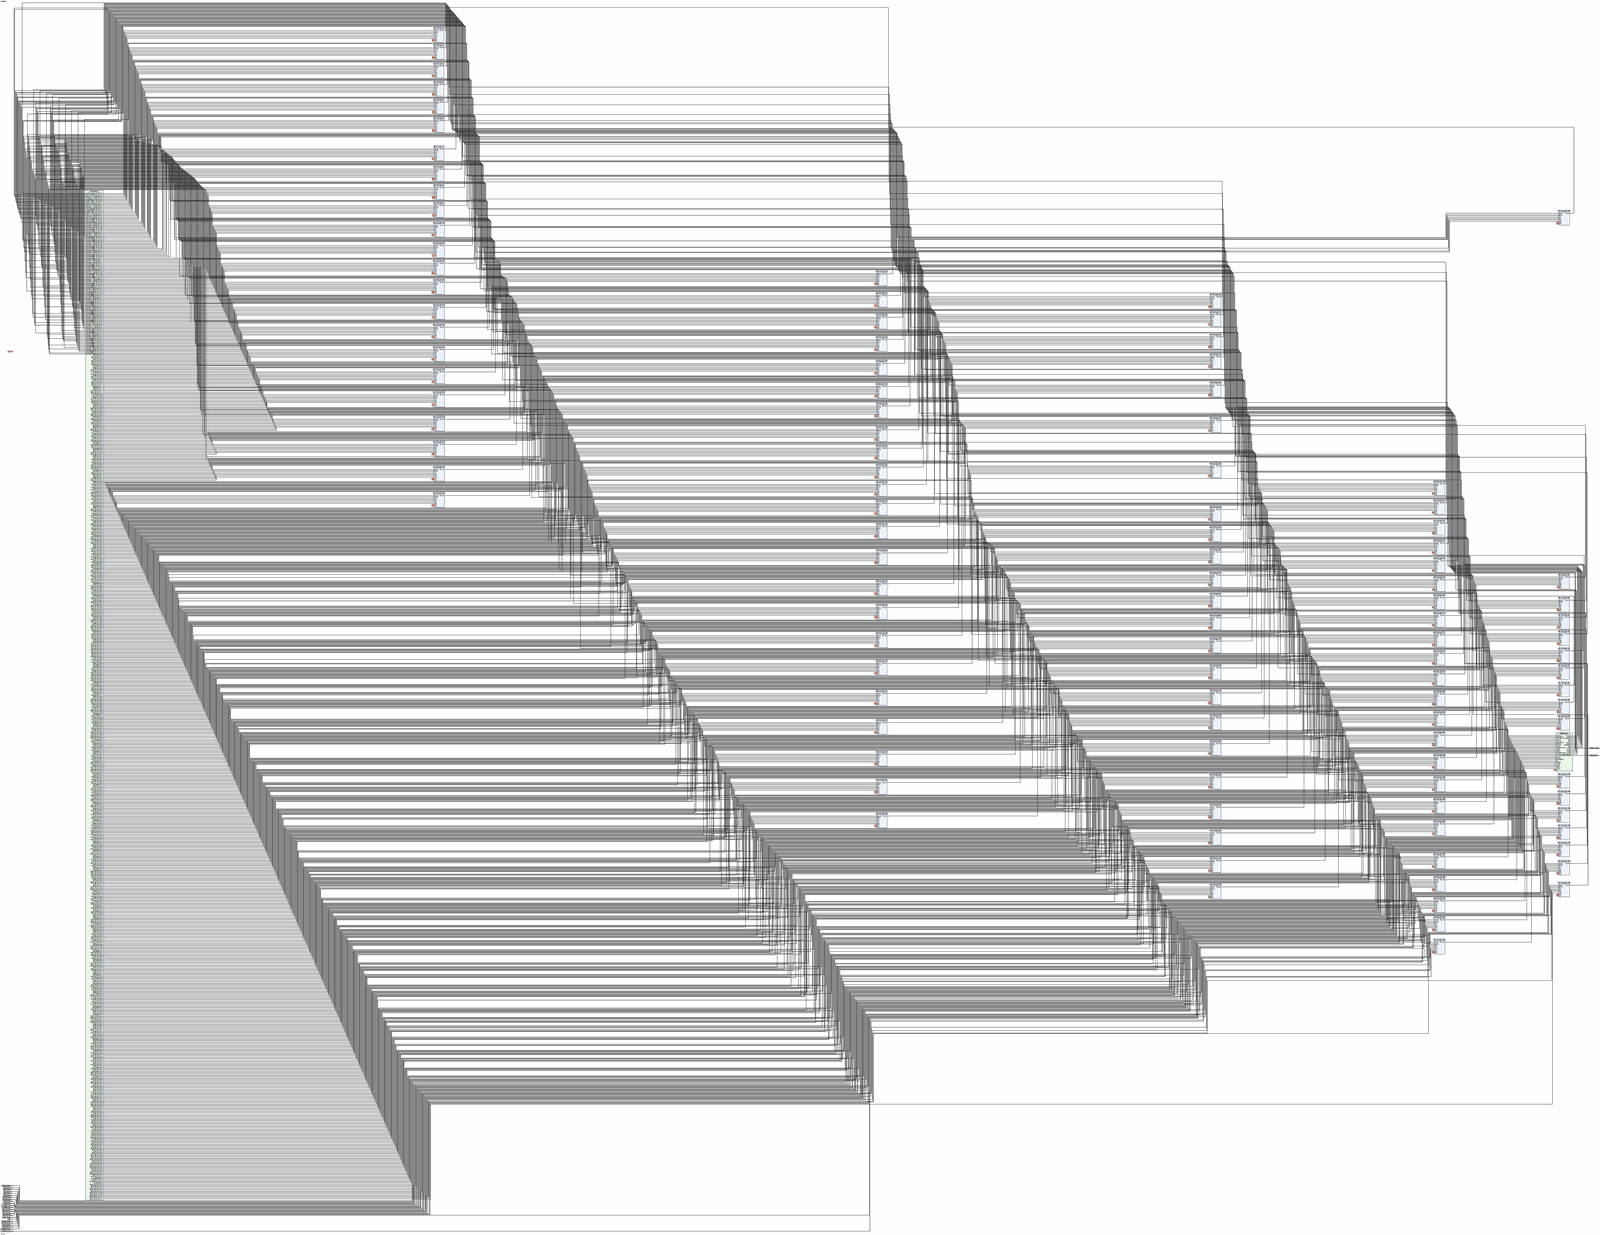
[diagram p0: block diagram of the top level, whole]
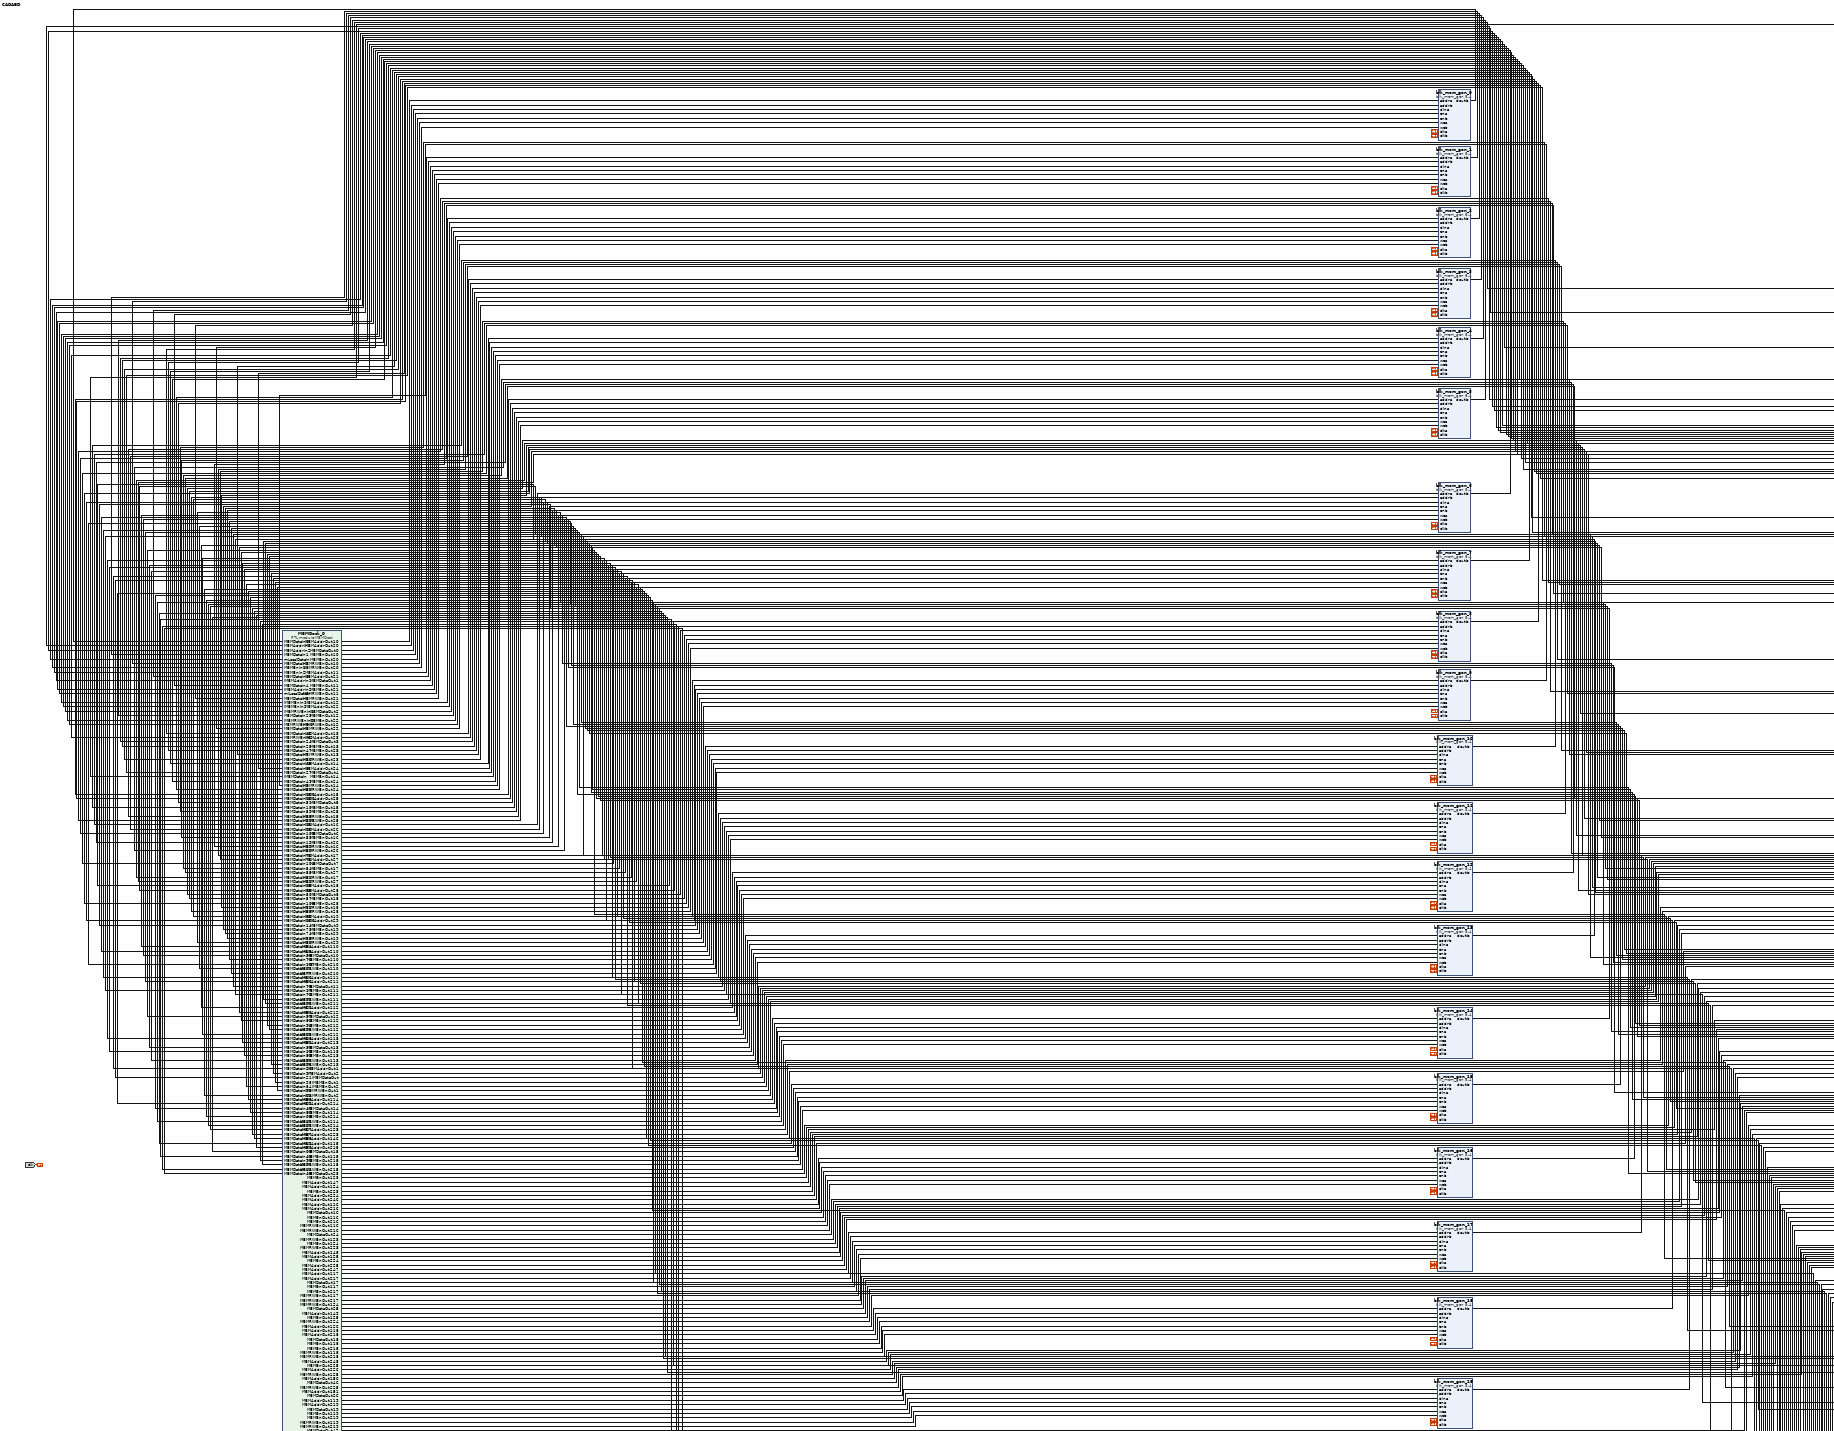
[diagram p1: block diagram of the top level, upper left part]
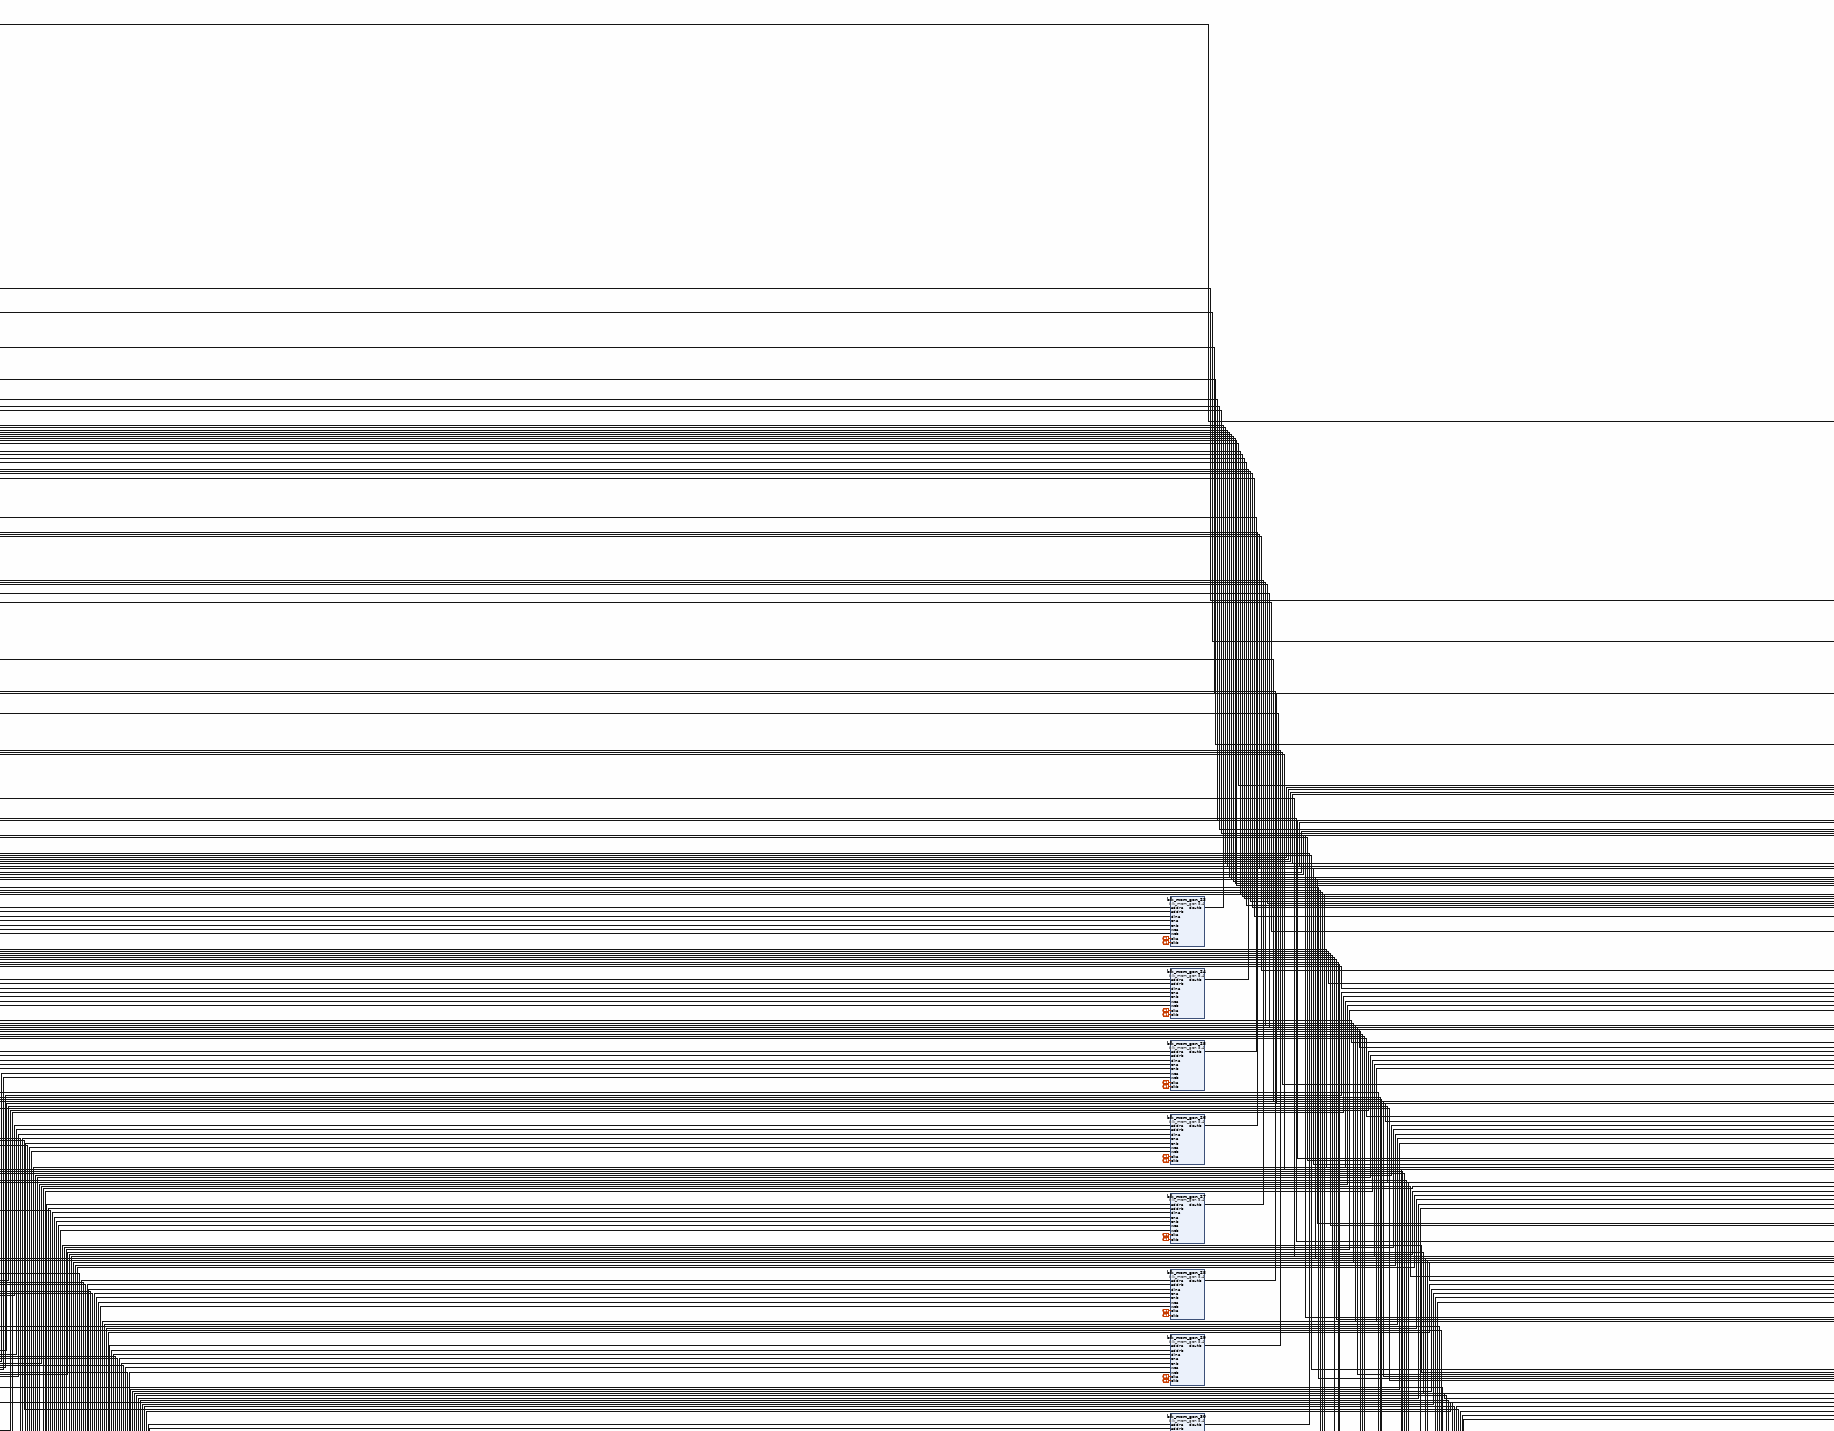
[diagram p2: block diagram of the top level, upper centre part]
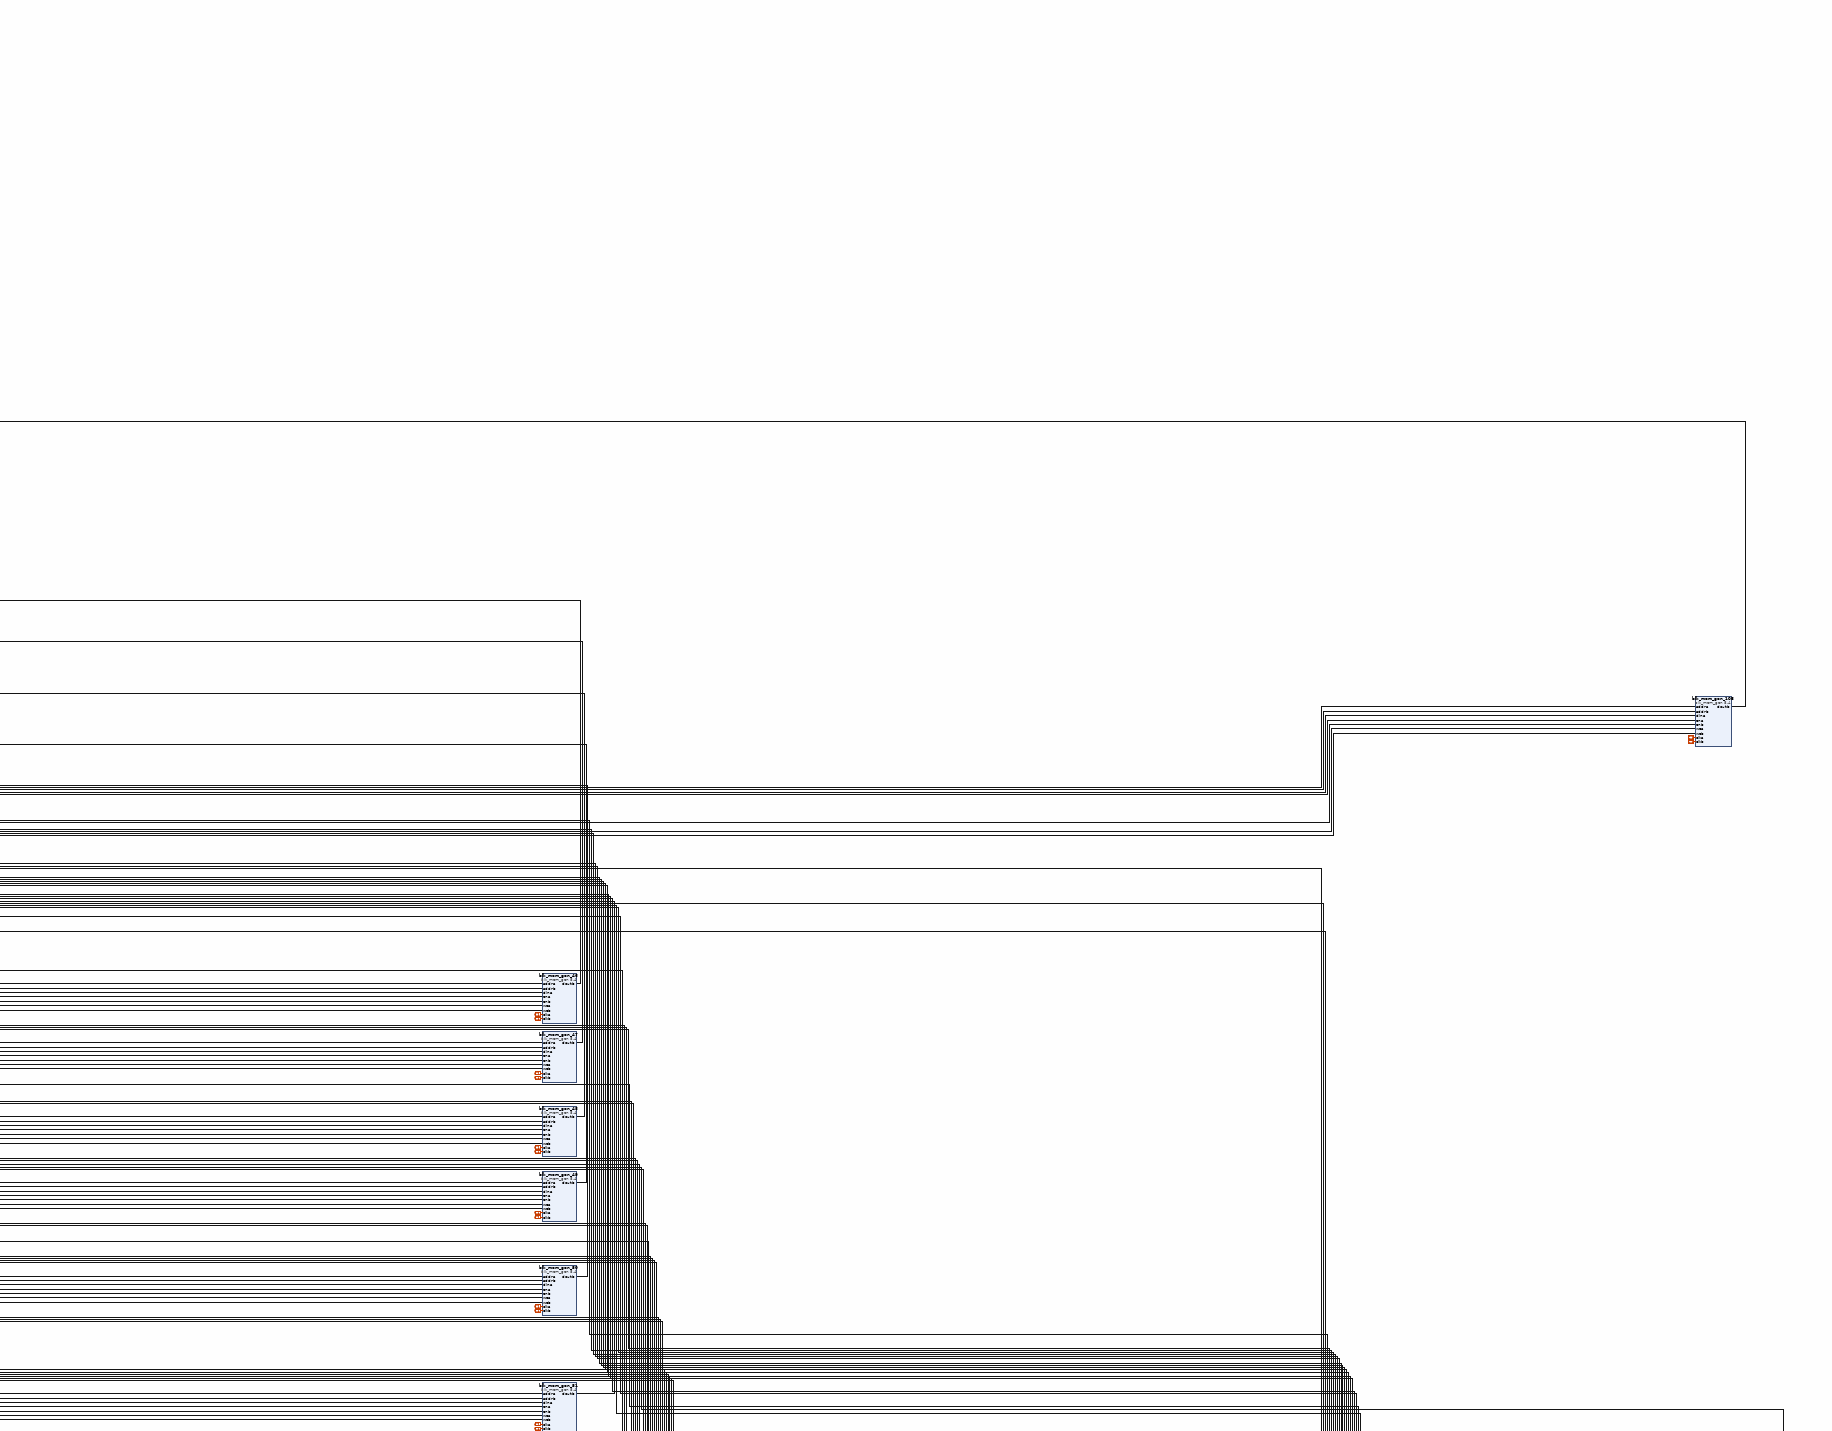
[diagram p3: block diagram of the top level, upper right part]
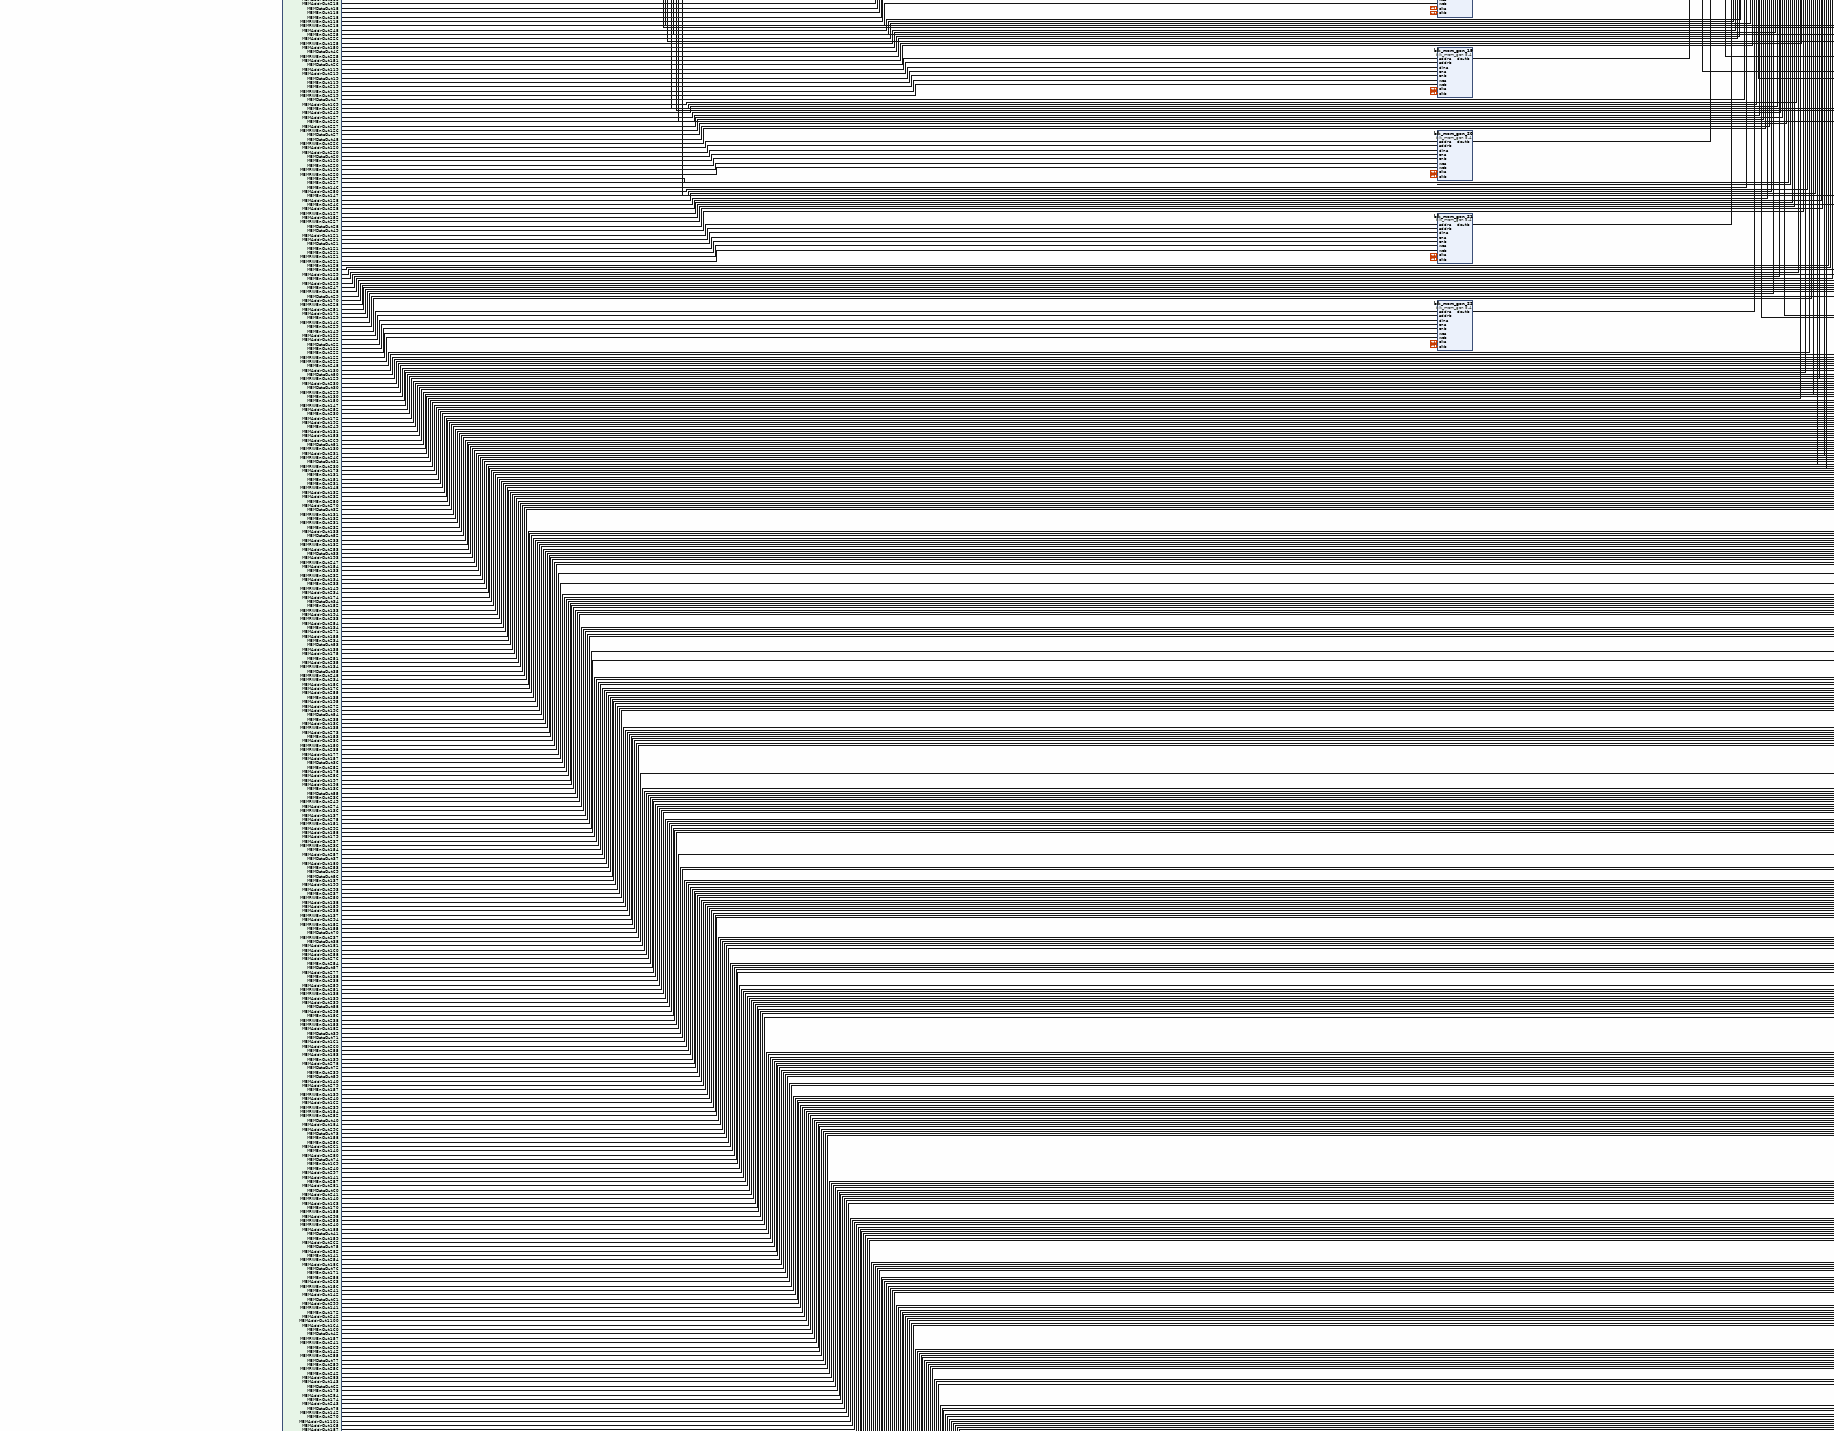
[diagram p4: block diagram of the top level, middle left part]
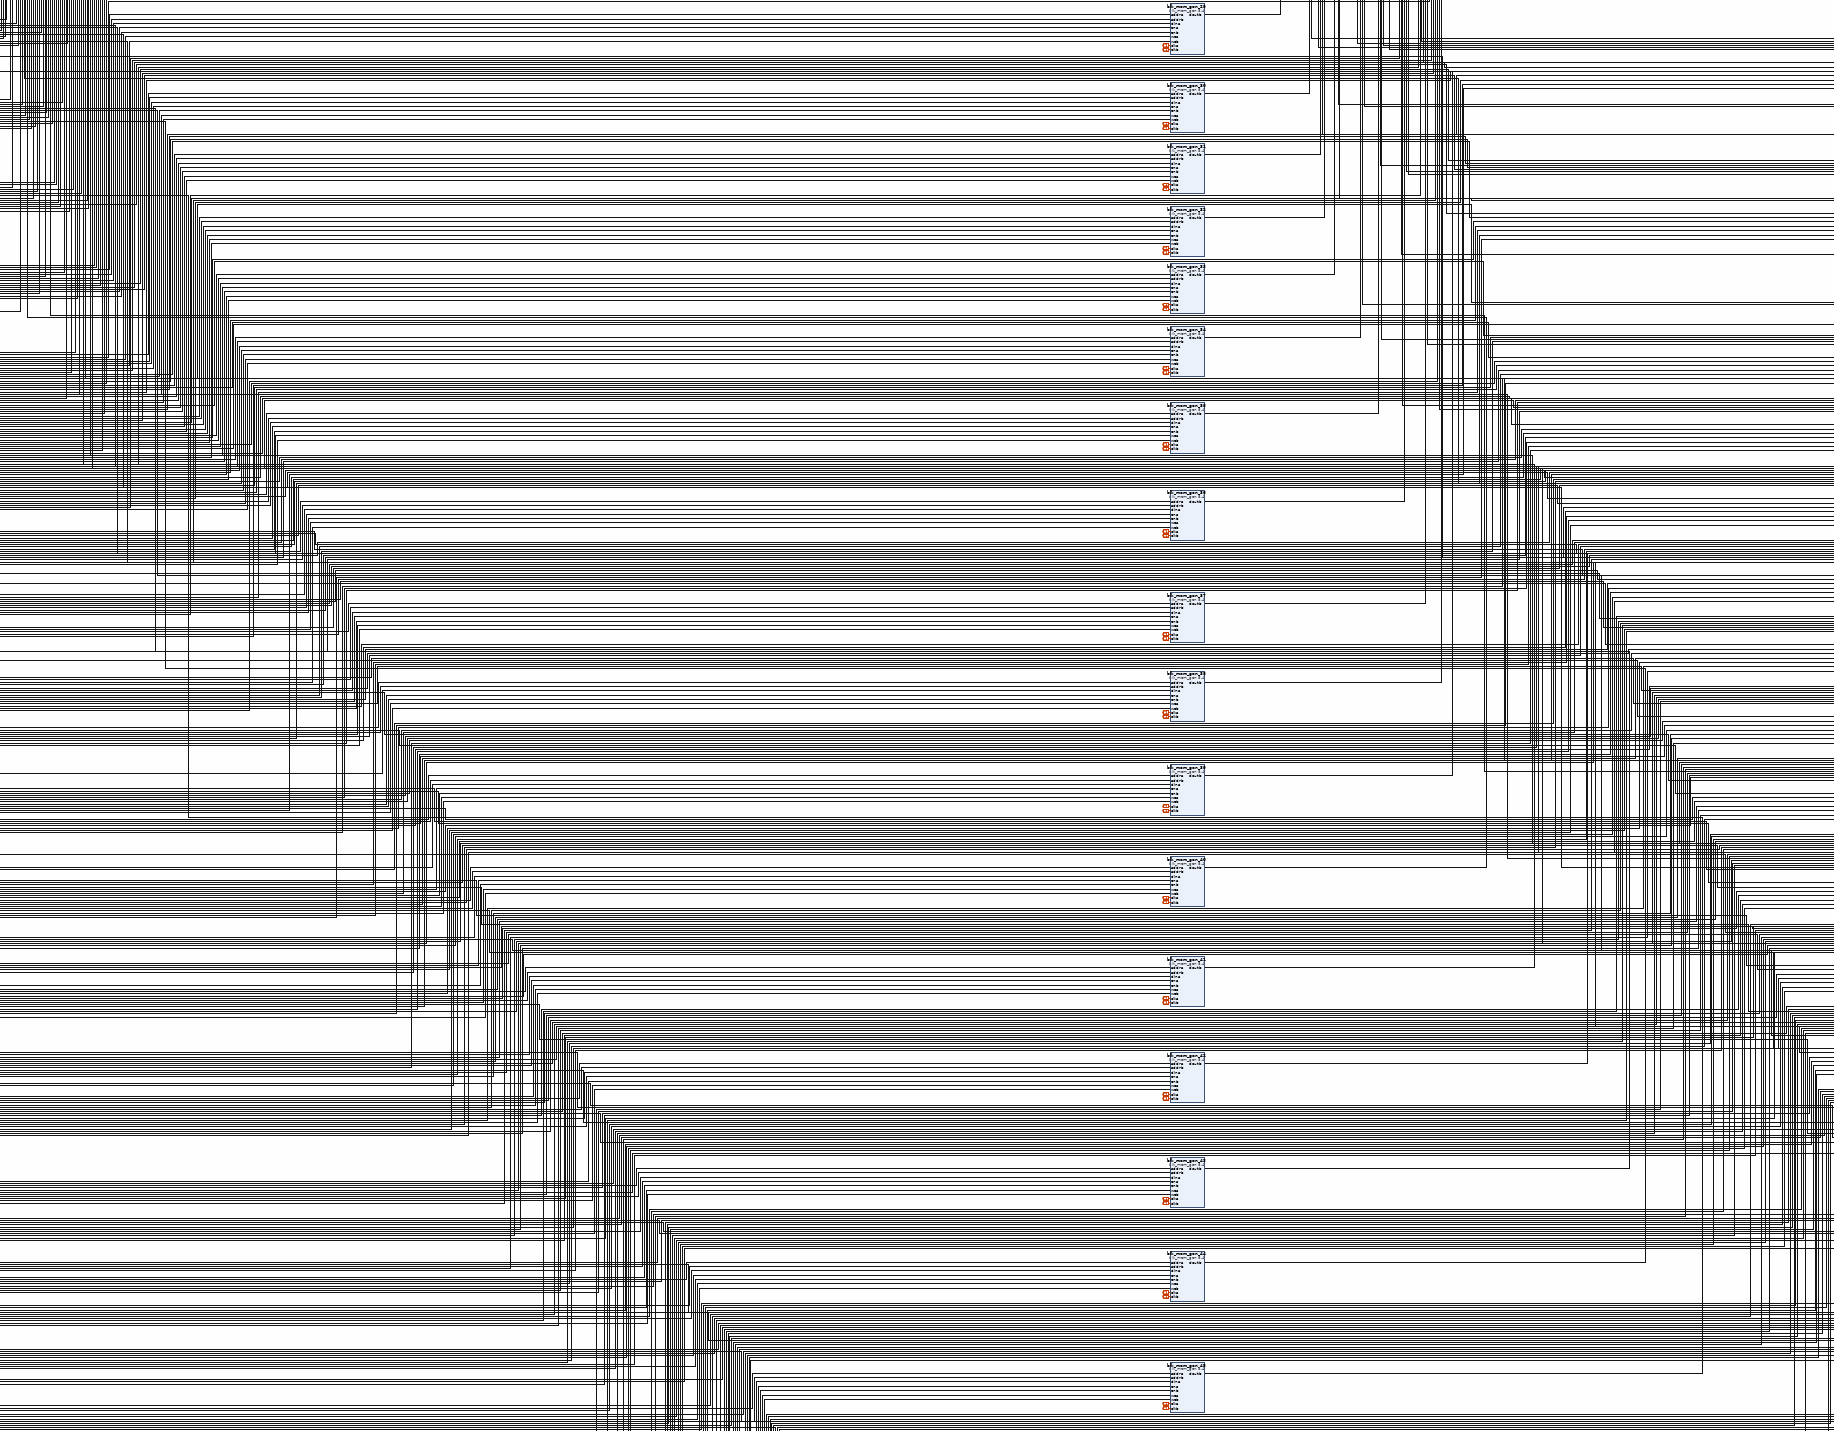
[diagram p5: block diagram of the top level, middle centre part]
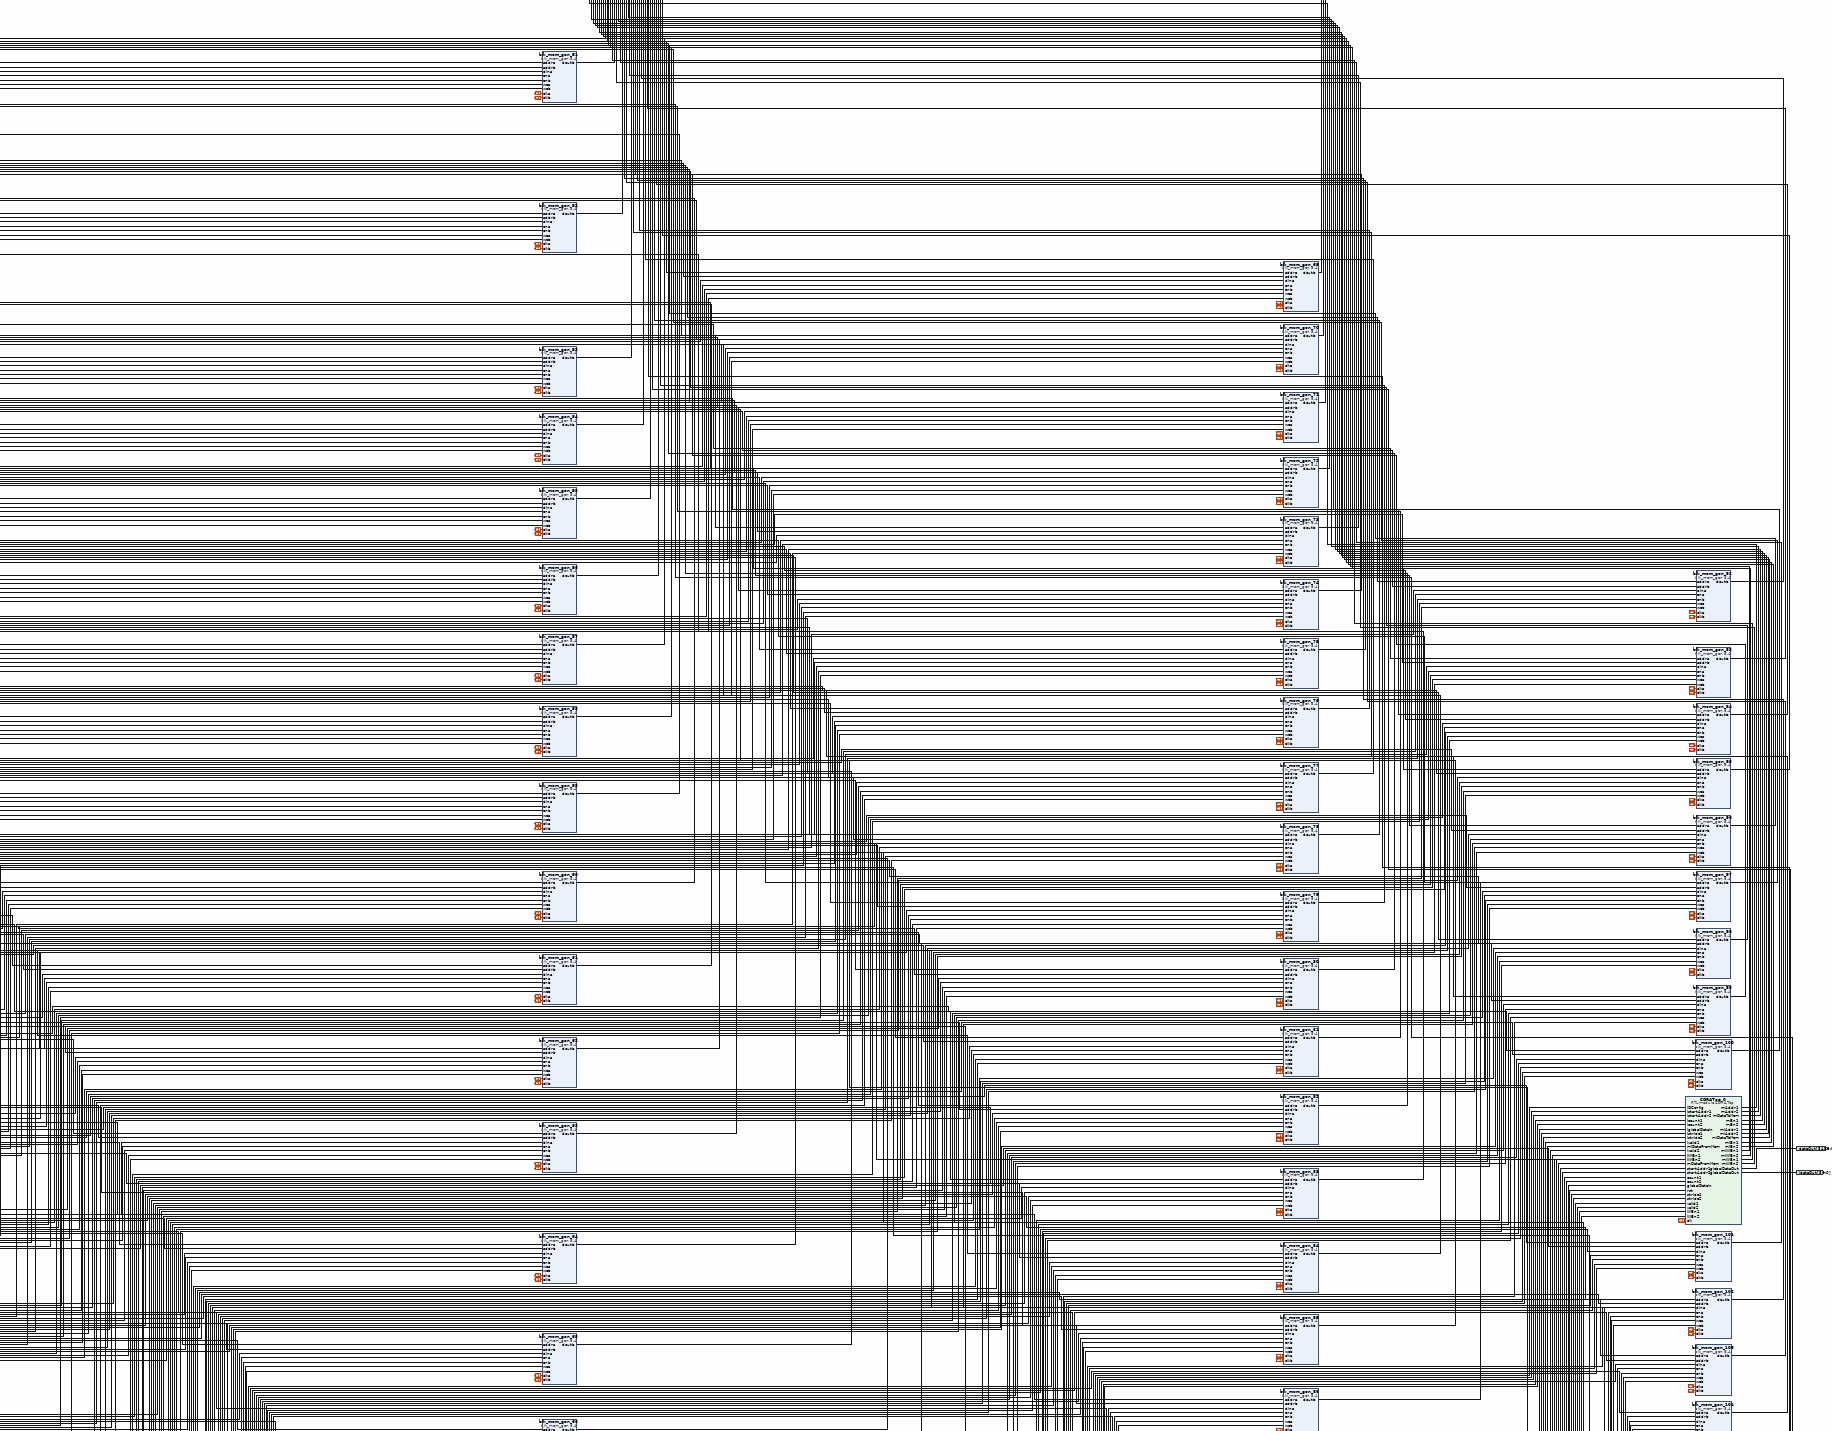
[diagram p6: block diagram of the top level, middle right part]
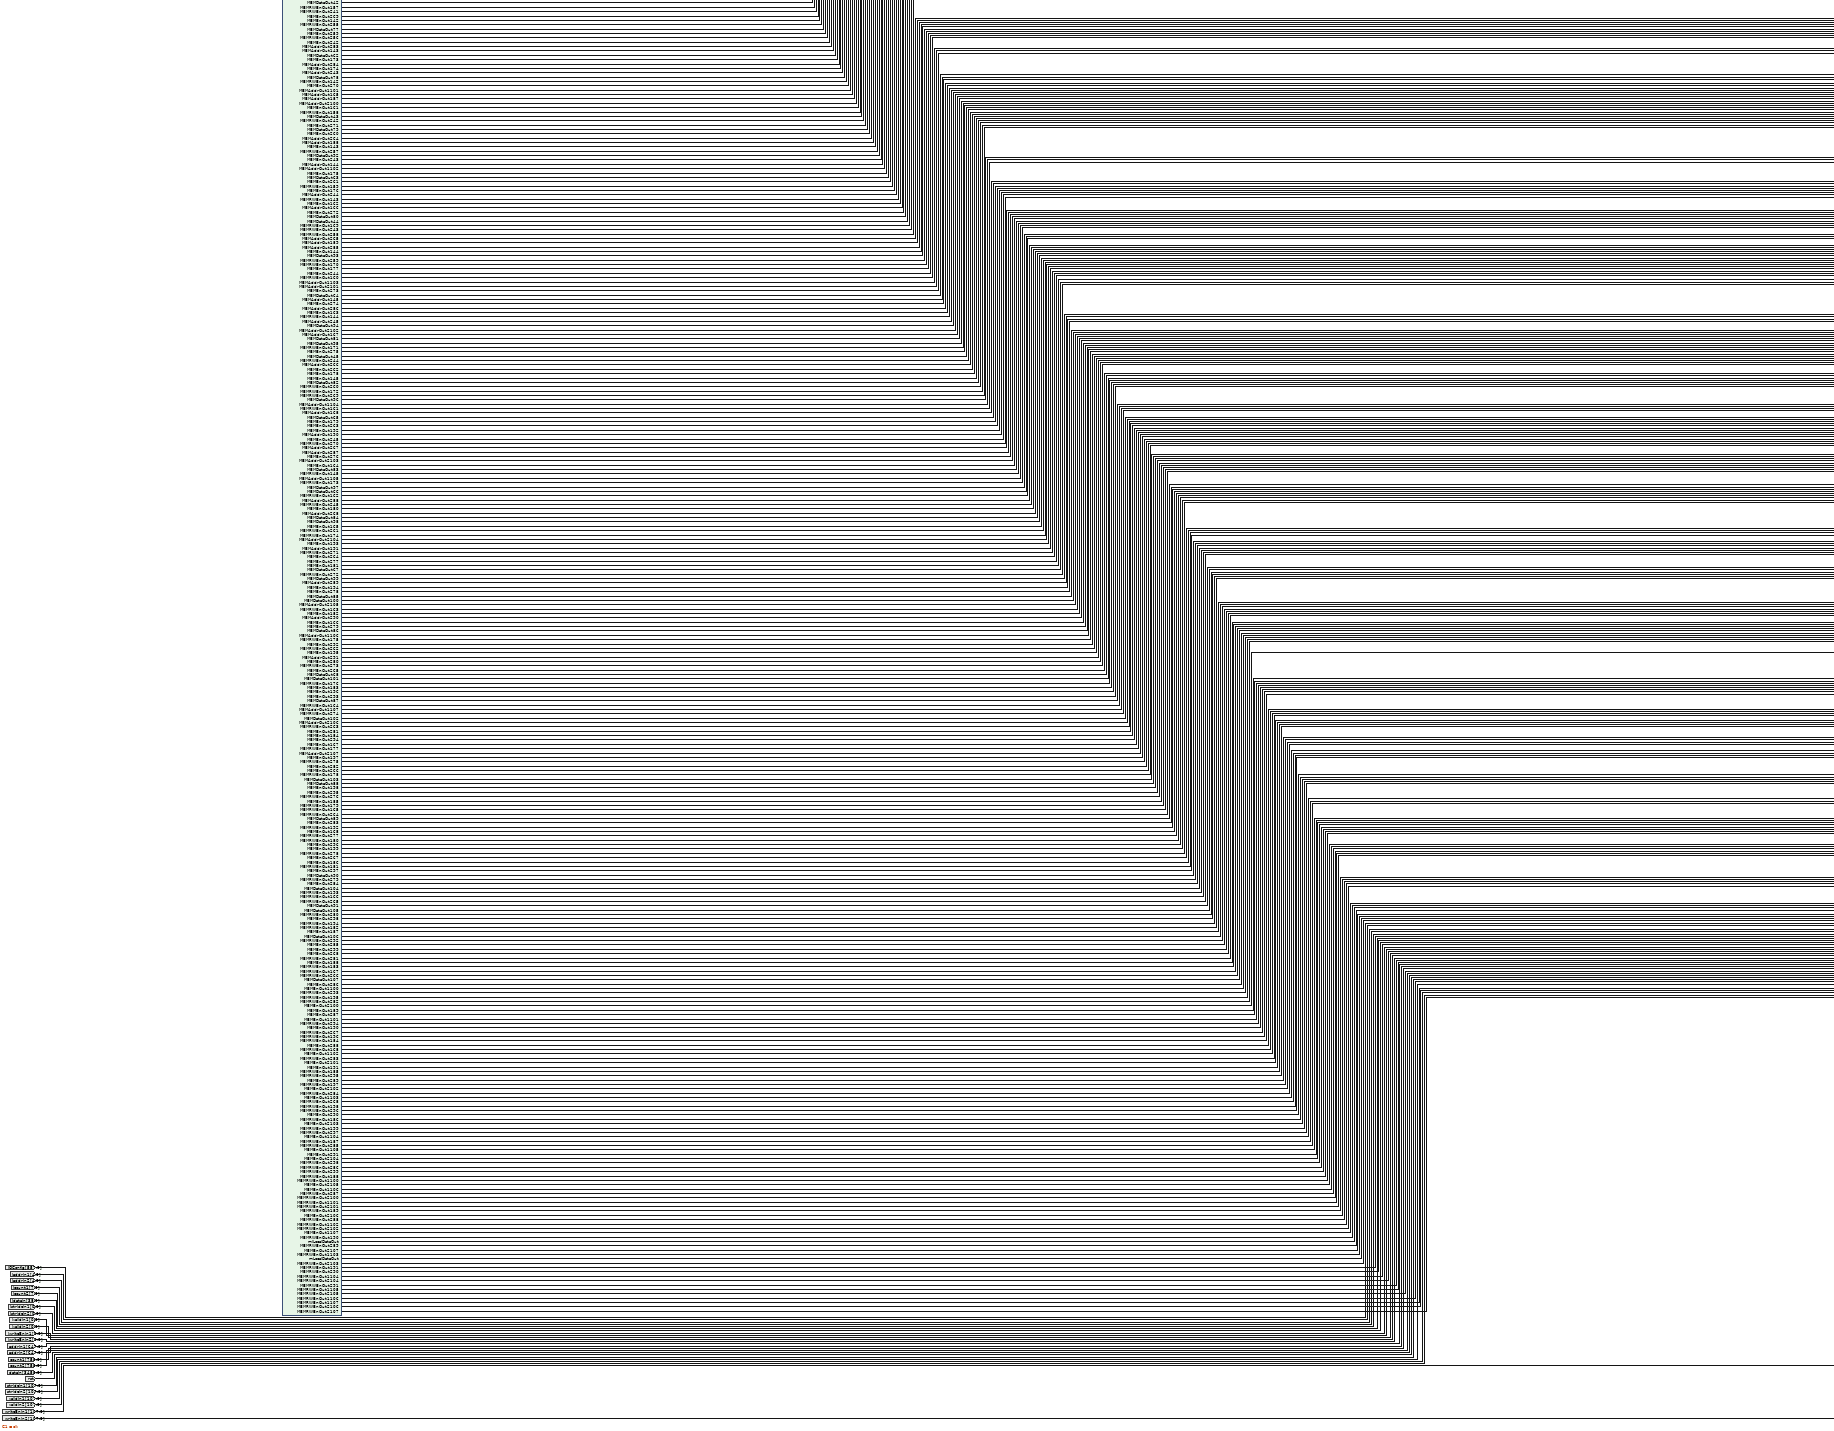
[diagram p7: block diagram of the top level, lower left part]
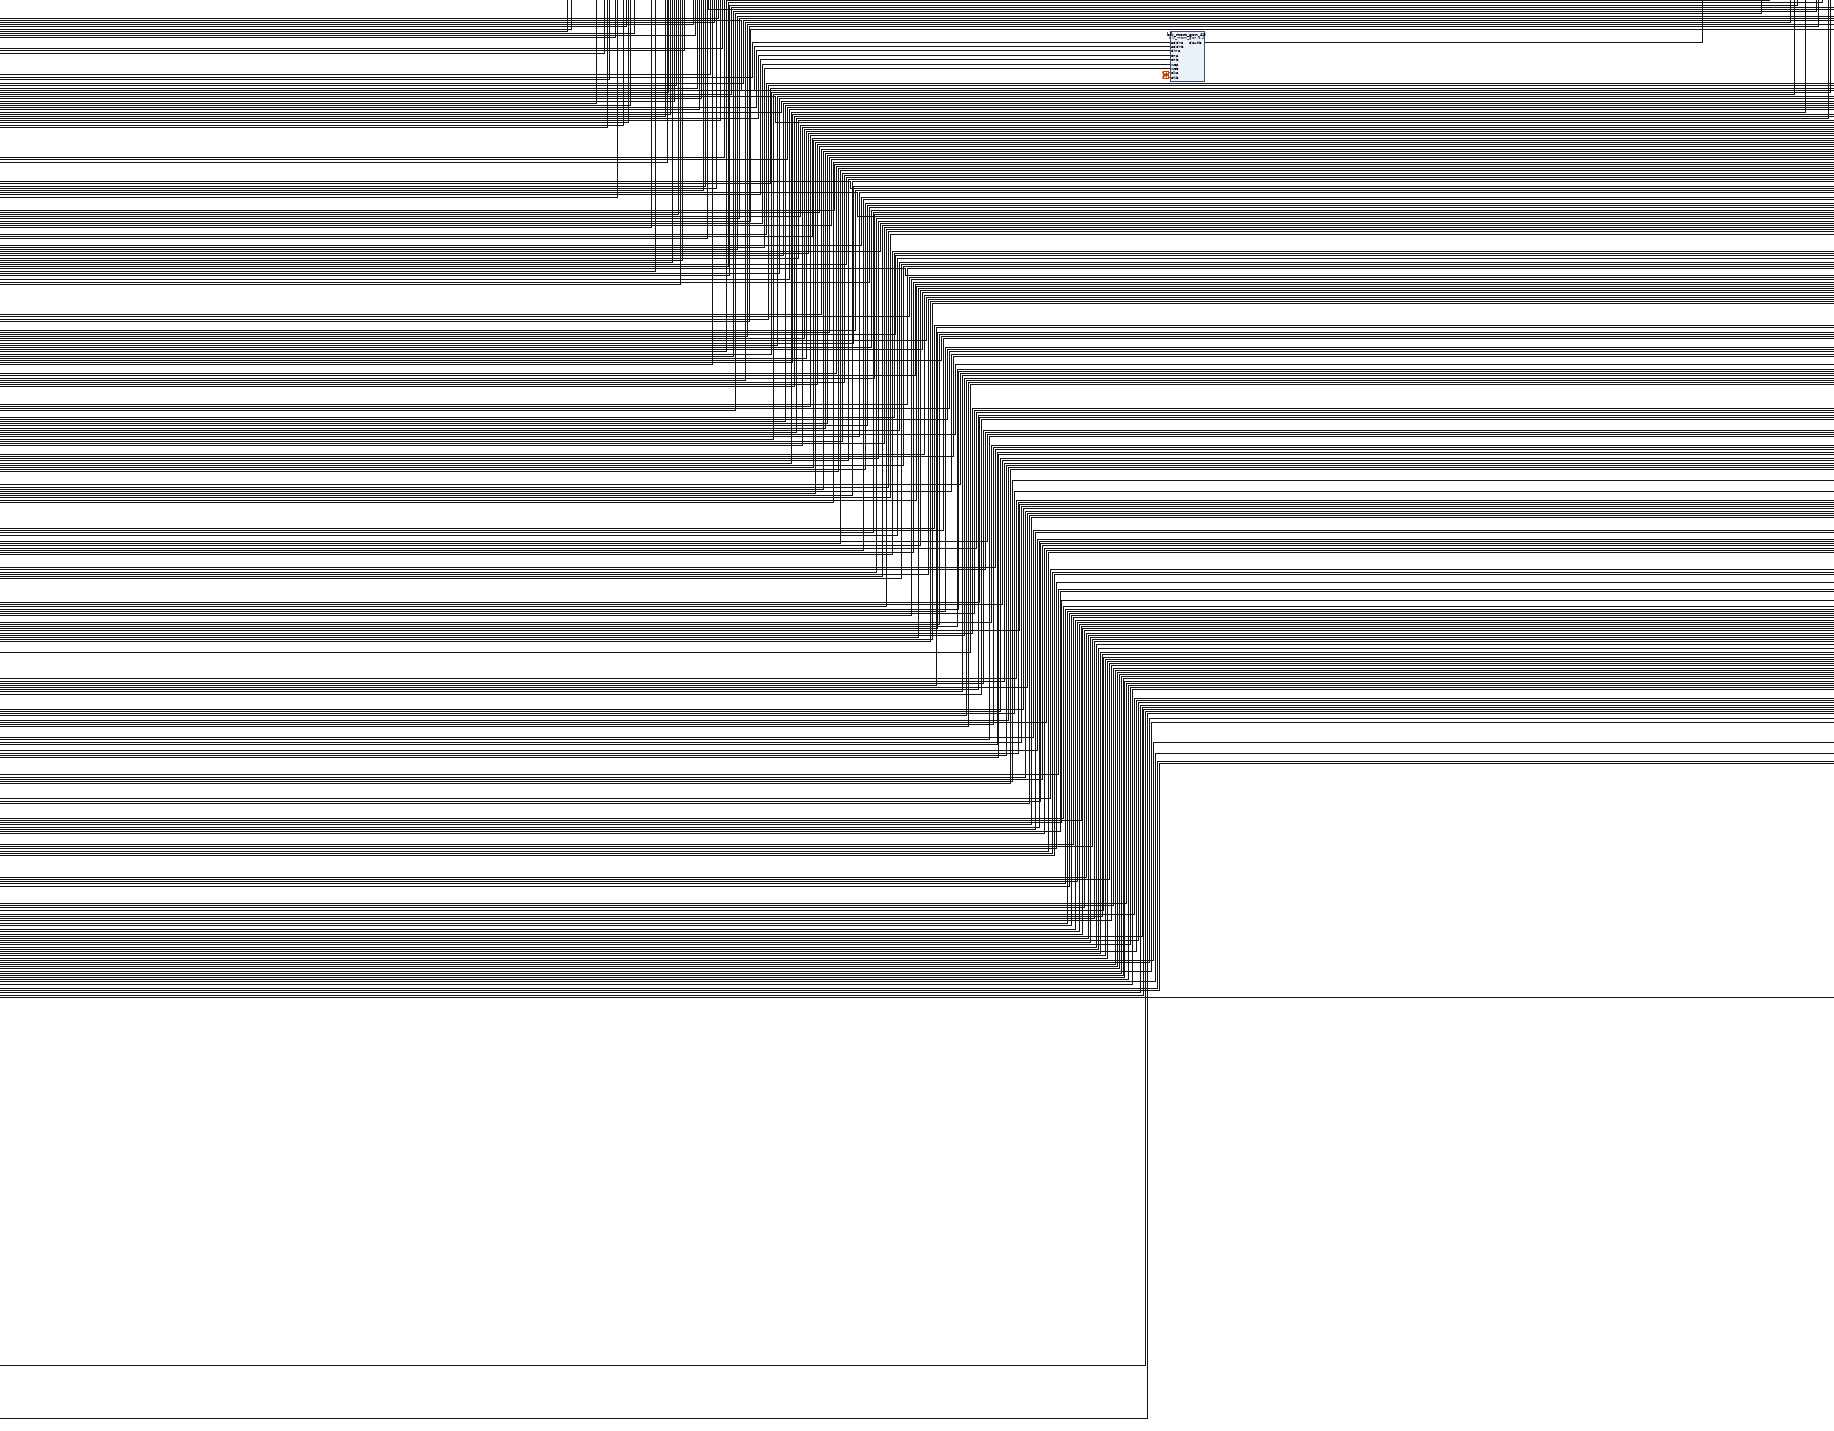
[diagram p8: block diagram of the top level, lower centre part]
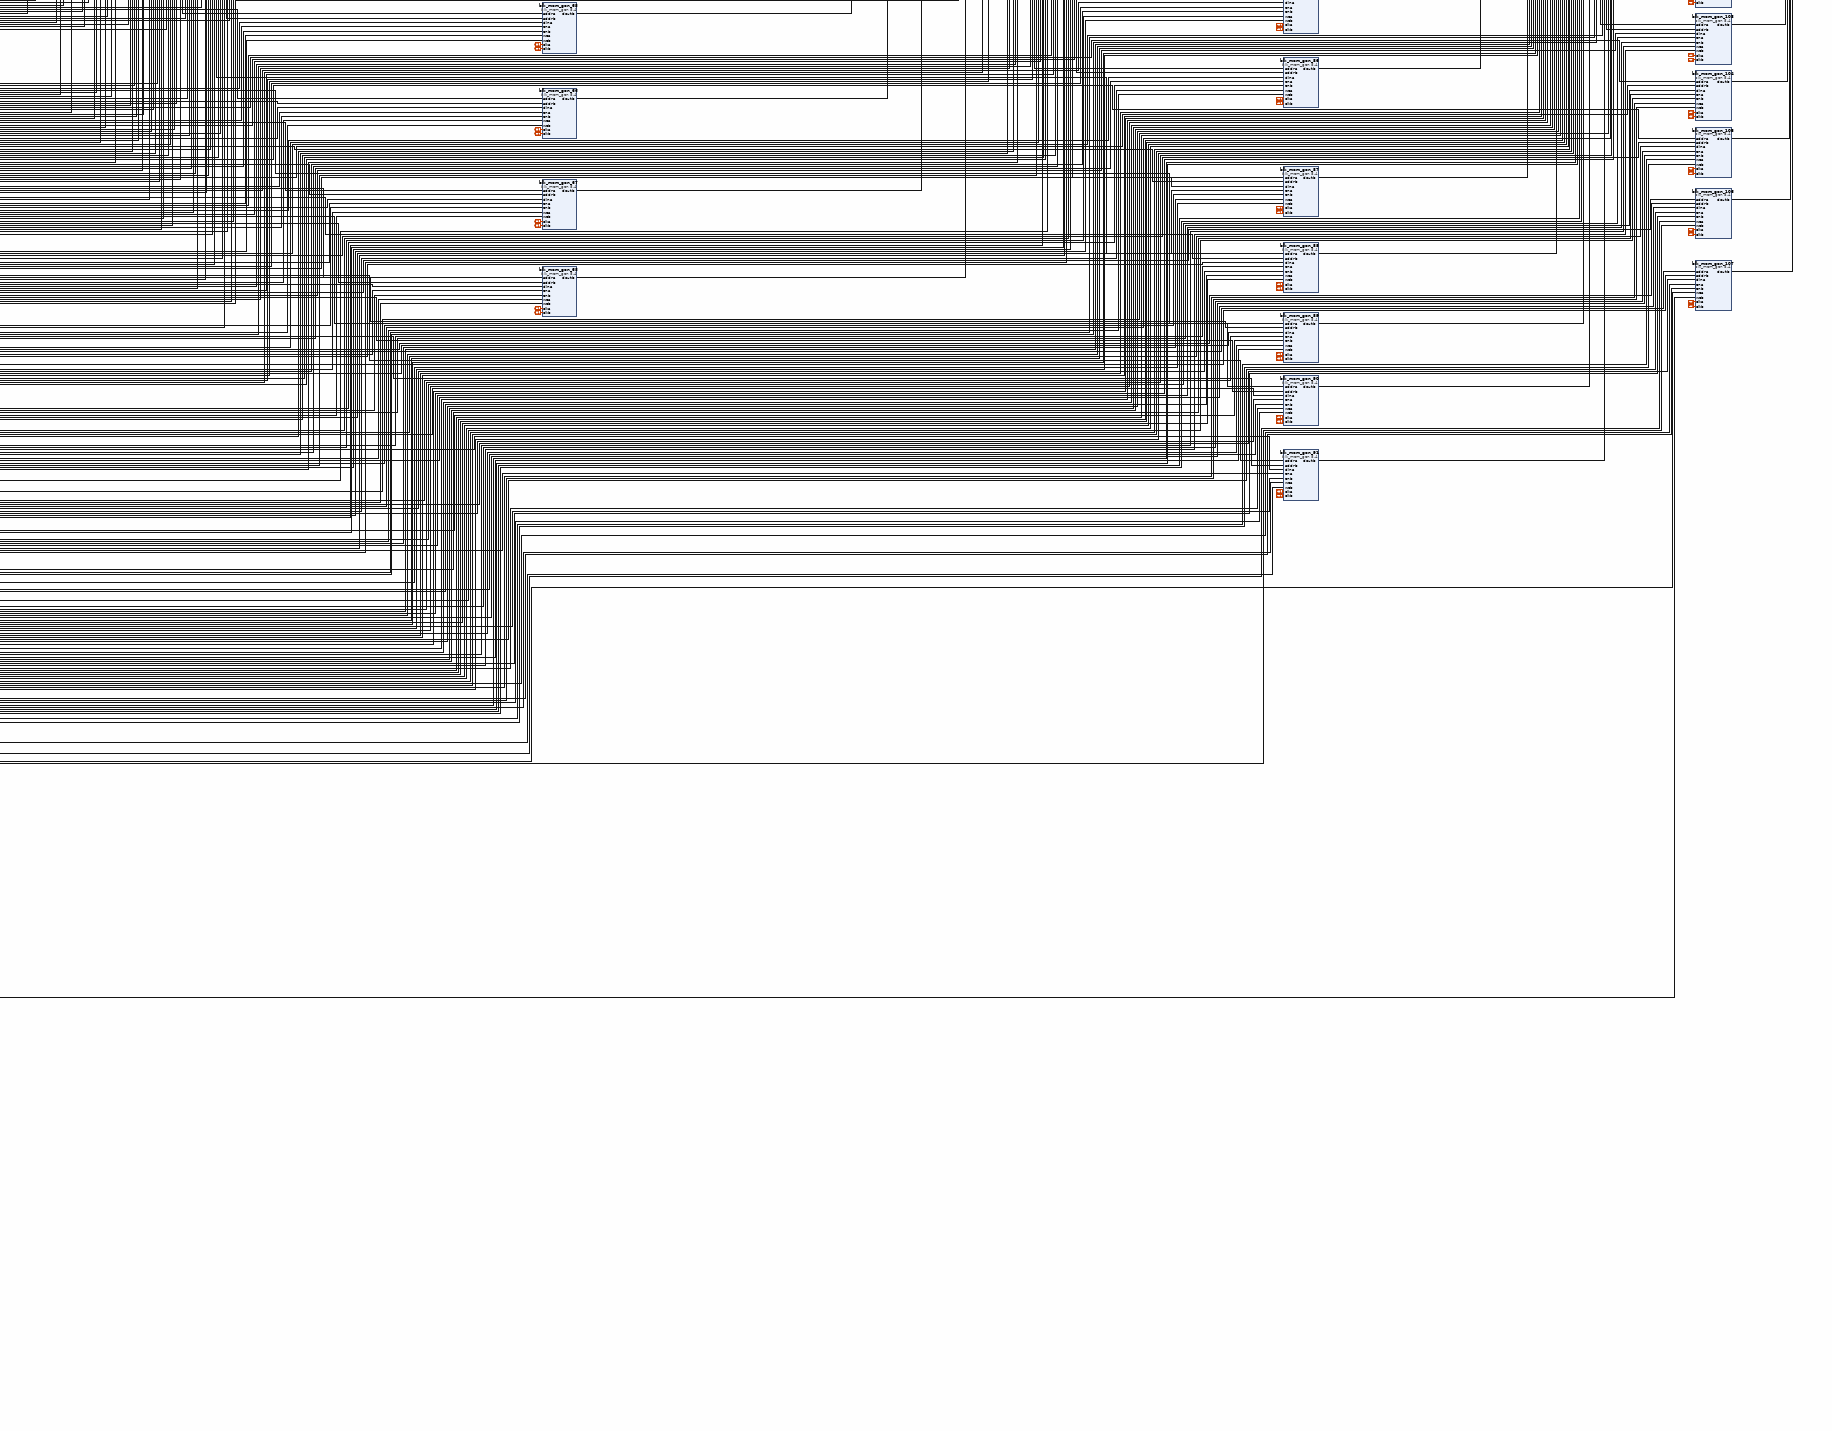
[diagram p9: block diagram of the top level, lower right part]
# Vivado block design CADABD, xc7z020clg400-2, Vivado 2023.2
create_bd_design CADABD

create_bd_port -dir I clk
create_bd_port -dir I rst
create_bd_port -dir I -from 3455 -to 0 dataIn
create_bd_port -dir O -from 3455 -to 0 dataOut
create_bd_port -dir I -from 38 -to 0 IdataIn
create_bd_port -dir O -from 38 -to 0 IdataOut
create_bd_port -dir I -from 107 -to 0 strideIn1
create_bd_port -dir I -from 647 -to 0 addrIn1
create_bd_port -dir I -from 755 -to 0 count1
create_bd_port -dir I -from 107 -to 0 validIn1
create_bd_port -dir I -from 107 -to 0 writeEnIn1
create_bd_port -dir I -from 107 -to 0 strideIn2
create_bd_port -dir I -from 647 -to 0 addrIn2
create_bd_port -dir I -from 755 -to 0 count2
create_bd_port -dir I -from 107 -to 0 validIn2
create_bd_port -dir I -from 107 -to 0 writeEnIn2
create_bd_port -dir I -from 557 -to 0 IOConfig
create_bd_port -dir I -from 0 -to 0 IstrideIn1
create_bd_port -dir I -from 4 -to 0 IaddrIn1
create_bd_port -dir I -from 7 -to 0 Icount1
create_bd_port -dir I -from 7 -to 0 Icount2
create_bd_port -dir I -from 0 -to 0 IvalidIn1
create_bd_port -dir I -from 0 -to 0 IwriteEnIn1
create_bd_port -dir I -from 0 -to 0 IstrideIn2
create_bd_port -dir I -from 4 -to 0 IaddrIn2
create_bd_port -dir I -from 0 -to 0 IvalidIn2
create_bd_port -dir I -from 0 -to 0 IwriteEnIn2

create_bd_cell -type module -reference MEMDock MEMDock_0
create_bd_cell -type ip -vlnv xilinx.com:ip:blk_mem_gen:8.4 blk_mem_gen_0
set_property -dict [list \
  CONFIG.Memory_Type True_Dual_Port_RAM \
  CONFIG.Read_Width_B 32 \
  CONFIG.Write_Depth_A 64 \
  CONFIG.Write_Width_A 32 \
  CONFIG.use_bram_block Stand_Alone \
] [get_bd_cells blk_mem_gen_0]
create_bd_cell -type ip -vlnv xilinx.com:ip:blk_mem_gen:8.4 blk_mem_gen_1
set_property -dict [list \
  CONFIG.Memory_Type True_Dual_Port_RAM \
  CONFIG.Read_Width_B 32 \
  CONFIG.Write_Depth_A 64 \
  CONFIG.Write_Width_A 32 \
  CONFIG.use_bram_block Stand_Alone \
] [get_bd_cells blk_mem_gen_1]
create_bd_cell -type ip -vlnv xilinx.com:ip:blk_mem_gen:8.4 blk_mem_gen_2
set_property -dict [list \
  CONFIG.Memory_Type True_Dual_Port_RAM \
  CONFIG.Read_Width_B 32 \
  CONFIG.Write_Depth_A 64 \
  CONFIG.Write_Width_A 32 \
  CONFIG.use_bram_block Stand_Alone \
] [get_bd_cells blk_mem_gen_2]
create_bd_cell -type ip -vlnv xilinx.com:ip:blk_mem_gen:8.4 blk_mem_gen_3
set_property -dict [list \
  CONFIG.Memory_Type True_Dual_Port_RAM \
  CONFIG.Read_Width_B 32 \
  CONFIG.Write_Depth_A 64 \
  CONFIG.Write_Width_A 32 \
  CONFIG.use_bram_block Stand_Alone \
] [get_bd_cells blk_mem_gen_3]
create_bd_cell -type ip -vlnv xilinx.com:ip:blk_mem_gen:8.4 blk_mem_gen_4
set_property -dict [list \
  CONFIG.Memory_Type True_Dual_Port_RAM \
  CONFIG.Read_Width_B 32 \
  CONFIG.Write_Depth_A 64 \
  CONFIG.Write_Width_A 32 \
  CONFIG.use_bram_block Stand_Alone \
] [get_bd_cells blk_mem_gen_4]
create_bd_cell -type ip -vlnv xilinx.com:ip:blk_mem_gen:8.4 blk_mem_gen_5
set_property -dict [list \
  CONFIG.Memory_Type True_Dual_Port_RAM \
  CONFIG.Read_Width_B 32 \
  CONFIG.Write_Depth_A 64 \
  CONFIG.Write_Width_A 32 \
  CONFIG.use_bram_block Stand_Alone \
] [get_bd_cells blk_mem_gen_5]
create_bd_cell -type ip -vlnv xilinx.com:ip:blk_mem_gen:8.4 blk_mem_gen_6
set_property -dict [list \
  CONFIG.Memory_Type True_Dual_Port_RAM \
  CONFIG.Read_Width_B 32 \
  CONFIG.Write_Depth_A 64 \
  CONFIG.Write_Width_A 32 \
  CONFIG.use_bram_block Stand_Alone \
] [get_bd_cells blk_mem_gen_6]
create_bd_cell -type ip -vlnv xilinx.com:ip:blk_mem_gen:8.4 blk_mem_gen_7
set_property -dict [list \
  CONFIG.Memory_Type True_Dual_Port_RAM \
  CONFIG.Read_Width_B 32 \
  CONFIG.Write_Depth_A 64 \
  CONFIG.Write_Width_A 32 \
  CONFIG.use_bram_block Stand_Alone \
] [get_bd_cells blk_mem_gen_7]
create_bd_cell -type ip -vlnv xilinx.com:ip:blk_mem_gen:8.4 blk_mem_gen_8
set_property -dict [list \
  CONFIG.Memory_Type True_Dual_Port_RAM \
  CONFIG.Read_Width_B 32 \
  CONFIG.Write_Depth_A 64 \
  CONFIG.Write_Width_A 32 \
  CONFIG.use_bram_block Stand_Alone \
] [get_bd_cells blk_mem_gen_8]
create_bd_cell -type ip -vlnv xilinx.com:ip:blk_mem_gen:8.4 blk_mem_gen_9
set_property -dict [list \
  CONFIG.Memory_Type True_Dual_Port_RAM \
  CONFIG.Read_Width_B 32 \
  CONFIG.Write_Depth_A 64 \
  CONFIG.Write_Width_A 32 \
  CONFIG.use_bram_block Stand_Alone \
] [get_bd_cells blk_mem_gen_9]
create_bd_cell -type ip -vlnv xilinx.com:ip:blk_mem_gen:8.4 blk_mem_gen_10
set_property -dict [list \
  CONFIG.Memory_Type True_Dual_Port_RAM \
  CONFIG.Read_Width_B 32 \
  CONFIG.Write_Depth_A 64 \
  CONFIG.Write_Width_A 32 \
  CONFIG.use_bram_block Stand_Alone \
] [get_bd_cells blk_mem_gen_10]
create_bd_cell -type ip -vlnv xilinx.com:ip:blk_mem_gen:8.4 blk_mem_gen_11
set_property -dict [list \
  CONFIG.Memory_Type True_Dual_Port_RAM \
  CONFIG.Read_Width_B 32 \
  CONFIG.Write_Depth_A 64 \
  CONFIG.Write_Width_A 32 \
  CONFIG.use_bram_block Stand_Alone \
] [get_bd_cells blk_mem_gen_11]
create_bd_cell -type ip -vlnv xilinx.com:ip:blk_mem_gen:8.4 blk_mem_gen_12
set_property -dict [list \
  CONFIG.Memory_Type True_Dual_Port_RAM \
  CONFIG.Read_Width_B 32 \
  CONFIG.Write_Depth_A 64 \
  CONFIG.Write_Width_A 32 \
  CONFIG.use_bram_block Stand_Alone \
] [get_bd_cells blk_mem_gen_12]
create_bd_cell -type ip -vlnv xilinx.com:ip:blk_mem_gen:8.4 blk_mem_gen_13
set_property -dict [list \
  CONFIG.Memory_Type True_Dual_Port_RAM \
  CONFIG.Read_Width_B 32 \
  CONFIG.Write_Depth_A 64 \
  CONFIG.Write_Width_A 32 \
  CONFIG.use_bram_block Stand_Alone \
] [get_bd_cells blk_mem_gen_13]
create_bd_cell -type ip -vlnv xilinx.com:ip:blk_mem_gen:8.4 blk_mem_gen_14
set_property -dict [list \
  CONFIG.Memory_Type True_Dual_Port_RAM \
  CONFIG.Read_Width_B 32 \
  CONFIG.Write_Depth_A 64 \
  CONFIG.Write_Width_A 32 \
  CONFIG.use_bram_block Stand_Alone \
] [get_bd_cells blk_mem_gen_14]
create_bd_cell -type ip -vlnv xilinx.com:ip:blk_mem_gen:8.4 blk_mem_gen_15
set_property -dict [list \
  CONFIG.Memory_Type True_Dual_Port_RAM \
  CONFIG.Read_Width_B 32 \
  CONFIG.Write_Depth_A 64 \
  CONFIG.Write_Width_A 32 \
  CONFIG.use_bram_block Stand_Alone \
] [get_bd_cells blk_mem_gen_15]
create_bd_cell -type ip -vlnv xilinx.com:ip:blk_mem_gen:8.4 blk_mem_gen_16
set_property -dict [list \
  CONFIG.Memory_Type True_Dual_Port_RAM \
  CONFIG.Read_Width_B 32 \
  CONFIG.Write_Depth_A 64 \
  CONFIG.Write_Width_A 32 \
  CONFIG.use_bram_block Stand_Alone \
] [get_bd_cells blk_mem_gen_16]
create_bd_cell -type ip -vlnv xilinx.com:ip:blk_mem_gen:8.4 blk_mem_gen_17
set_property -dict [list \
  CONFIG.Memory_Type True_Dual_Port_RAM \
  CONFIG.Read_Width_B 32 \
  CONFIG.Write_Depth_A 64 \
  CONFIG.Write_Width_A 32 \
  CONFIG.use_bram_block Stand_Alone \
] [get_bd_cells blk_mem_gen_17]
create_bd_cell -type ip -vlnv xilinx.com:ip:blk_mem_gen:8.4 blk_mem_gen_18
set_property -dict [list \
  CONFIG.Memory_Type True_Dual_Port_RAM \
  CONFIG.Read_Width_B 32 \
  CONFIG.Write_Depth_A 64 \
  CONFIG.Write_Width_A 32 \
  CONFIG.use_bram_block Stand_Alone \
] [get_bd_cells blk_mem_gen_18]
create_bd_cell -type ip -vlnv xilinx.com:ip:blk_mem_gen:8.4 blk_mem_gen_19
set_property -dict [list \
  CONFIG.Memory_Type True_Dual_Port_RAM \
  CONFIG.Read_Width_B 32 \
  CONFIG.Write_Depth_A 64 \
  CONFIG.Write_Width_A 32 \
  CONFIG.use_bram_block Stand_Alone \
] [get_bd_cells blk_mem_gen_19]
create_bd_cell -type ip -vlnv xilinx.com:ip:blk_mem_gen:8.4 blk_mem_gen_20
set_property -dict [list \
  CONFIG.Memory_Type True_Dual_Port_RAM \
  CONFIG.Read_Width_B 32 \
  CONFIG.Write_Depth_A 64 \
  CONFIG.Write_Width_A 32 \
  CONFIG.use_bram_block Stand_Alone \
] [get_bd_cells blk_mem_gen_20]
create_bd_cell -type ip -vlnv xilinx.com:ip:blk_mem_gen:8.4 blk_mem_gen_21
set_property -dict [list \
  CONFIG.Memory_Type True_Dual_Port_RAM \
  CONFIG.Read_Width_B 32 \
  CONFIG.Write_Depth_A 64 \
  CONFIG.Write_Width_A 32 \
  CONFIG.use_bram_block Stand_Alone \
] [get_bd_cells blk_mem_gen_21]
create_bd_cell -type ip -vlnv xilinx.com:ip:blk_mem_gen:8.4 blk_mem_gen_22
set_property -dict [list \
  CONFIG.Memory_Type True_Dual_Port_RAM \
  CONFIG.Read_Width_B 32 \
  CONFIG.Write_Depth_A 64 \
  CONFIG.Write_Width_A 32 \
  CONFIG.use_bram_block Stand_Alone \
] [get_bd_cells blk_mem_gen_22]
create_bd_cell -type ip -vlnv xilinx.com:ip:blk_mem_gen:8.4 blk_mem_gen_23
set_property -dict [list \
  CONFIG.Memory_Type True_Dual_Port_RAM \
  CONFIG.Read_Width_B 32 \
  CONFIG.Write_Depth_A 64 \
  CONFIG.Write_Width_A 32 \
  CONFIG.use_bram_block Stand_Alone \
] [get_bd_cells blk_mem_gen_23]
create_bd_cell -type ip -vlnv xilinx.com:ip:blk_mem_gen:8.4 blk_mem_gen_24
set_property -dict [list \
  CONFIG.Memory_Type True_Dual_Port_RAM \
  CONFIG.Read_Width_B 32 \
  CONFIG.Write_Depth_A 64 \
  CONFIG.Write_Width_A 32 \
  CONFIG.use_bram_block Stand_Alone \
] [get_bd_cells blk_mem_gen_24]
create_bd_cell -type ip -vlnv xilinx.com:ip:blk_mem_gen:8.4 blk_mem_gen_25
set_property -dict [list \
  CONFIG.Memory_Type True_Dual_Port_RAM \
  CONFIG.Read_Width_B 32 \
  CONFIG.Write_Depth_A 64 \
  CONFIG.Write_Width_A 32 \
  CONFIG.use_bram_block Stand_Alone \
] [get_bd_cells blk_mem_gen_25]
create_bd_cell -type ip -vlnv xilinx.com:ip:blk_mem_gen:8.4 blk_mem_gen_26
set_property -dict [list \
  CONFIG.Memory_Type True_Dual_Port_RAM \
  CONFIG.Read_Width_B 32 \
  CONFIG.Write_Depth_A 64 \
  CONFIG.Write_Width_A 32 \
  CONFIG.use_bram_block Stand_Alone \
] [get_bd_cells blk_mem_gen_26]
create_bd_cell -type ip -vlnv xilinx.com:ip:blk_mem_gen:8.4 blk_mem_gen_27
set_property -dict [list \
  CONFIG.Memory_Type True_Dual_Port_RAM \
  CONFIG.Read_Width_B 32 \
  CONFIG.Write_Depth_A 64 \
  CONFIG.Write_Width_A 32 \
  CONFIG.use_bram_block Stand_Alone \
] [get_bd_cells blk_mem_gen_27]
create_bd_cell -type ip -vlnv xilinx.com:ip:blk_mem_gen:8.4 blk_mem_gen_28
set_property -dict [list \
  CONFIG.Memory_Type True_Dual_Port_RAM \
  CONFIG.Read_Width_B 32 \
  CONFIG.Write_Depth_A 64 \
  CONFIG.Write_Width_A 32 \
  CONFIG.use_bram_block Stand_Alone \
] [get_bd_cells blk_mem_gen_28]
create_bd_cell -type ip -vlnv xilinx.com:ip:blk_mem_gen:8.4 blk_mem_gen_29
set_property -dict [list \
  CONFIG.Memory_Type True_Dual_Port_RAM \
  CONFIG.Read_Width_B 32 \
  CONFIG.Write_Depth_A 64 \
  CONFIG.Write_Width_A 32 \
  CONFIG.use_bram_block Stand_Alone \
] [get_bd_cells blk_mem_gen_29]
create_bd_cell -type ip -vlnv xilinx.com:ip:blk_mem_gen:8.4 blk_mem_gen_30
set_property -dict [list \
  CONFIG.Memory_Type True_Dual_Port_RAM \
  CONFIG.Read_Width_B 32 \
  CONFIG.Write_Depth_A 64 \
  CONFIG.Write_Width_A 32 \
  CONFIG.use_bram_block Stand_Alone \
] [get_bd_cells blk_mem_gen_30]
create_bd_cell -type ip -vlnv xilinx.com:ip:blk_mem_gen:8.4 blk_mem_gen_31
set_property -dict [list \
  CONFIG.Memory_Type True_Dual_Port_RAM \
  CONFIG.Read_Width_B 32 \
  CONFIG.Write_Depth_A 64 \
  CONFIG.Write_Width_A 32 \
  CONFIG.use_bram_block Stand_Alone \
] [get_bd_cells blk_mem_gen_31]
create_bd_cell -type ip -vlnv xilinx.com:ip:blk_mem_gen:8.4 blk_mem_gen_32
set_property -dict [list \
  CONFIG.Memory_Type True_Dual_Port_RAM \
  CONFIG.Read_Width_B 32 \
  CONFIG.Write_Depth_A 64 \
  CONFIG.Write_Width_A 32 \
  CONFIG.use_bram_block Stand_Alone \
] [get_bd_cells blk_mem_gen_32]
create_bd_cell -type ip -vlnv xilinx.com:ip:blk_mem_gen:8.4 blk_mem_gen_33
set_property -dict [list \
  CONFIG.Memory_Type True_Dual_Port_RAM \
  CONFIG.Read_Width_B 32 \
  CONFIG.Write_Depth_A 64 \
  CONFIG.Write_Width_A 32 \
  CONFIG.use_bram_block Stand_Alone \
] [get_bd_cells blk_mem_gen_33]
create_bd_cell -type ip -vlnv xilinx.com:ip:blk_mem_gen:8.4 blk_mem_gen_34
set_property -dict [list \
  CONFIG.Memory_Type True_Dual_Port_RAM \
  CONFIG.Read_Width_B 32 \
  CONFIG.Write_Depth_A 64 \
  CONFIG.Write_Width_A 32 \
  CONFIG.use_bram_block Stand_Alone \
] [get_bd_cells blk_mem_gen_34]
create_bd_cell -type ip -vlnv xilinx.com:ip:blk_mem_gen:8.4 blk_mem_gen_35
set_property -dict [list \
  CONFIG.Memory_Type True_Dual_Port_RAM \
  CONFIG.Read_Width_B 32 \
  CONFIG.Write_Depth_A 64 \
  CONFIG.Write_Width_A 32 \
  CONFIG.use_bram_block Stand_Alone \
] [get_bd_cells blk_mem_gen_35]
create_bd_cell -type ip -vlnv xilinx.com:ip:blk_mem_gen:8.4 blk_mem_gen_36
set_property -dict [list \
  CONFIG.Memory_Type True_Dual_Port_RAM \
  CONFIG.Read_Width_B 32 \
  CONFIG.Write_Depth_A 64 \
  CONFIG.Write_Width_A 32 \
  CONFIG.use_bram_block Stand_Alone \
] [get_bd_cells blk_mem_gen_36]
create_bd_cell -type ip -vlnv xilinx.com:ip:blk_mem_gen:8.4 blk_mem_gen_37
set_property -dict [list \
  CONFIG.Memory_Type True_Dual_Port_RAM \
  CONFIG.Read_Width_B 32 \
  CONFIG.Write_Depth_A 64 \
  CONFIG.Write_Width_A 32 \
  CONFIG.use_bram_block Stand_Alone \
] [get_bd_cells blk_mem_gen_37]
create_bd_cell -type ip -vlnv xilinx.com:ip:blk_mem_gen:8.4 blk_mem_gen_38
set_property -dict [list \
  CONFIG.Memory_Type True_Dual_Port_RAM \
  CONFIG.Read_Width_B 32 \
  CONFIG.Write_Depth_A 64 \
  CONFIG.Write_Width_A 32 \
  CONFIG.use_bram_block Stand_Alone \
] [get_bd_cells blk_mem_gen_38]
create_bd_cell -type ip -vlnv xilinx.com:ip:blk_mem_gen:8.4 blk_mem_gen_39
set_property -dict [list \
  CONFIG.Memory_Type True_Dual_Port_RAM \
  CONFIG.Read_Width_B 32 \
  CONFIG.Write_Depth_A 64 \
  CONFIG.Write_Width_A 32 \
  CONFIG.use_bram_block Stand_Alone \
] [get_bd_cells blk_mem_gen_39]
create_bd_cell -type ip -vlnv xilinx.com:ip:blk_mem_gen:8.4 blk_mem_gen_40
set_property -dict [list \
  CONFIG.Memory_Type True_Dual_Port_RAM \
  CONFIG.Read_Width_B 32 \
  CONFIG.Write_Depth_A 64 \
  CONFIG.Write_Width_A 32 \
  CONFIG.use_bram_block Stand_Alone \
] [get_bd_cells blk_mem_gen_40]
create_bd_cell -type ip -vlnv xilinx.com:ip:blk_mem_gen:8.4 blk_mem_gen_41
set_property -dict [list \
  CONFIG.Memory_Type True_Dual_Port_RAM \
  CONFIG.Read_Width_B 32 \
  CONFIG.Write_Depth_A 64 \
  CONFIG.Write_Width_A 32 \
  CONFIG.use_bram_block Stand_Alone \
] [get_bd_cells blk_mem_gen_41]
create_bd_cell -type ip -vlnv xilinx.com:ip:blk_mem_gen:8.4 blk_mem_gen_42
set_property -dict [list \
  CONFIG.Memory_Type True_Dual_Port_RAM \
  CONFIG.Read_Width_B 32 \
  CONFIG.Write_Depth_A 64 \
  CONFIG.Write_Width_A 32 \
  CONFIG.use_bram_block Stand_Alone \
] [get_bd_cells blk_mem_gen_42]
create_bd_cell -type ip -vlnv xilinx.com:ip:blk_mem_gen:8.4 blk_mem_gen_43
set_property -dict [list \
  CONFIG.Memory_Type True_Dual_Port_RAM \
  CONFIG.Read_Width_B 32 \
  CONFIG.Write_Depth_A 64 \
  CONFIG.Write_Width_A 32 \
  CONFIG.use_bram_block Stand_Alone \
] [get_bd_cells blk_mem_gen_43]
create_bd_cell -type ip -vlnv xilinx.com:ip:blk_mem_gen:8.4 blk_mem_gen_44
set_property -dict [list \
  CONFIG.Memory_Type True_Dual_Port_RAM \
  CONFIG.Read_Width_B 32 \
  CONFIG.Write_Depth_A 64 \
  CONFIG.Write_Width_A 32 \
  CONFIG.use_bram_block Stand_Alone \
] [get_bd_cells blk_mem_gen_44]
create_bd_cell -type ip -vlnv xilinx.com:ip:blk_mem_gen:8.4 blk_mem_gen_45
set_property -dict [list \
  CONFIG.Memory_Type True_Dual_Port_RAM \
  CONFIG.Read_Width_B 32 \
  CONFIG.Write_Depth_A 64 \
  CONFIG.Write_Width_A 32 \
  CONFIG.use_bram_block Stand_Alone \
] [get_bd_cells blk_mem_gen_45]
create_bd_cell -type ip -vlnv xilinx.com:ip:blk_mem_gen:8.4 blk_mem_gen_46
set_property -dict [list \
  CONFIG.Memory_Type True_Dual_Port_RAM \
  CONFIG.Read_Width_B 32 \
  CONFIG.Write_Depth_A 64 \
  CONFIG.Write_Width_A 32 \
  CONFIG.use_bram_block Stand_Alone \
] [get_bd_cells blk_mem_gen_46]
create_bd_cell -type ip -vlnv xilinx.com:ip:blk_mem_gen:8.4 blk_mem_gen_47
set_property -dict [list \
  CONFIG.Memory_Type True_Dual_Port_RAM \
  CONFIG.Read_Width_B 32 \
  CONFIG.Write_Depth_A 64 \
  CONFIG.Write_Width_A 32 \
  CONFIG.use_bram_block Stand_Alone \
] [get_bd_cells blk_mem_gen_47]
create_bd_cell -type ip -vlnv xilinx.com:ip:blk_mem_gen:8.4 blk_mem_gen_48
set_property -dict [list \
  CONFIG.Memory_Type True_Dual_Port_RAM \
  CONFIG.Read_Width_B 32 \
  CONFIG.Write_Depth_A 64 \
  CONFIG.Write_Width_A 32 \
  CONFIG.use_bram_block Stand_Alone \
] [get_bd_cells blk_mem_gen_48]
create_bd_cell -type ip -vlnv xilinx.com:ip:blk_mem_gen:8.4 blk_mem_gen_49
set_property -dict [list \
  CONFIG.Memory_Type True_Dual_Port_RAM \
  CONFIG.Read_Width_B 32 \
  CONFIG.Write_Depth_A 64 \
  CONFIG.Write_Width_A 32 \
  CONFIG.use_bram_block Stand_Alone \
] [get_bd_cells blk_mem_gen_49]
create_bd_cell -type ip -vlnv xilinx.com:ip:blk_mem_gen:8.4 blk_mem_gen_50
set_property -dict [list \
  CONFIG.Memory_Type True_Dual_Port_RAM \
  CONFIG.Read_Width_B 32 \
  CONFIG.Write_Depth_A 64 \
  CONFIG.Write_Width_A 32 \
  CONFIG.use_bram_block Stand_Alone \
] [get_bd_cells blk_mem_gen_50]
create_bd_cell -type ip -vlnv xilinx.com:ip:blk_mem_gen:8.4 blk_mem_gen_51
set_property -dict [list \
  CONFIG.Memory_Type True_Dual_Port_RAM \
  CONFIG.Read_Width_B 32 \
  CONFIG.Write_Depth_A 64 \
  CONFIG.Write_Width_A 32 \
  CONFIG.use_bram_block Stand_Alone \
] [get_bd_cells blk_mem_gen_51]
create_bd_cell -type ip -vlnv xilinx.com:ip:blk_mem_gen:8.4 blk_mem_gen_52
set_property -dict [list \
  CONFIG.Memory_Type True_Dual_Port_RAM \
  CONFIG.Read_Width_B 32 \
  CONFIG.Write_Depth_A 64 \
  CONFIG.Write_Width_A 32 \
  CONFIG.use_bram_block Stand_Alone \
] [get_bd_cells blk_mem_gen_52]
create_bd_cell -type ip -vlnv xilinx.com:ip:blk_mem_gen:8.4 blk_mem_gen_53
set_property -dict [list \
  CONFIG.Memory_Type True_Dual_Port_RAM \
  CONFIG.Read_Width_B 32 \
  CONFIG.Write_Depth_A 64 \
  CONFIG.Write_Width_A 32 \
  CONFIG.use_bram_block Stand_Alone \
] [get_bd_cells blk_mem_gen_53]
create_bd_cell -type ip -vlnv xilinx.com:ip:blk_mem_gen:8.4 blk_mem_gen_54
set_property -dict [list \
  CONFIG.Memory_Type True_Dual_Port_RAM \
  CONFIG.Read_Width_B 32 \
  CONFIG.Write_Depth_A 64 \
  CONFIG.Write_Width_A 32 \
  CONFIG.use_bram_block Stand_Alone \
] [get_bd_cells blk_mem_gen_54]
create_bd_cell -type ip -vlnv xilinx.com:ip:blk_mem_gen:8.4 blk_mem_gen_55
set_property -dict [list \
  CONFIG.Memory_Type True_Dual_Port_RAM \
  CONFIG.Read_Width_B 32 \
  CONFIG.Write_Depth_A 64 \
  CONFIG.Write_Width_A 32 \
  CONFIG.use_bram_block Stand_Alone \
] [get_bd_cells blk_mem_gen_55]
create_bd_cell -type ip -vlnv xilinx.com:ip:blk_mem_gen:8.4 blk_mem_gen_56
set_property -dict [list \
  CONFIG.Memory_Type True_Dual_Port_RAM \
  CONFIG.Read_Width_B 32 \
  CONFIG.Write_Depth_A 64 \
  CONFIG.Write_Width_A 32 \
  CONFIG.use_bram_block Stand_Alone \
] [get_bd_cells blk_mem_gen_56]
create_bd_cell -type ip -vlnv xilinx.com:ip:blk_mem_gen:8.4 blk_mem_gen_57
set_property -dict [list \
  CONFIG.Memory_Type True_Dual_Port_RAM \
  CONFIG.Read_Width_B 32 \
  CONFIG.Write_Depth_A 64 \
  CONFIG.Write_Width_A 32 \
  CONFIG.use_bram_block Stand_Alone \
] [get_bd_cells blk_mem_gen_57]
create_bd_cell -type ip -vlnv xilinx.com:ip:blk_mem_gen:8.4 blk_mem_gen_58
set_property -dict [list \
  CONFIG.Memory_Type True_Dual_Port_RAM \
  CONFIG.Read_Width_B 32 \
  CONFIG.Write_Depth_A 64 \
  CONFIG.Write_Width_A 32 \
  CONFIG.use_bram_block Stand_Alone \
] [get_bd_cells blk_mem_gen_58]
create_bd_cell -type ip -vlnv xilinx.com:ip:blk_mem_gen:8.4 blk_mem_gen_59
set_property -dict [list \
  CONFIG.Memory_Type True_Dual_Port_RAM \
  CONFIG.Read_Width_B 32 \
  CONFIG.Write_Depth_A 64 \
  CONFIG.Write_Width_A 32 \
  CONFIG.use_bram_block Stand_Alone \
] [get_bd_cells blk_mem_gen_59]
create_bd_cell -type ip -vlnv xilinx.com:ip:blk_mem_gen:8.4 blk_mem_gen_60
set_property -dict [list \
  CONFIG.Memory_Type True_Dual_Port_RAM \
  CONFIG.Read_Width_B 32 \
  CONFIG.Write_Depth_A 64 \
  CONFIG.Write_Width_A 32 \
  CONFIG.use_bram_block Stand_Alone \
] [get_bd_cells blk_mem_gen_60]
create_bd_cell -type ip -vlnv xilinx.com:ip:blk_mem_gen:8.4 blk_mem_gen_61
set_property -dict [list \
  CONFIG.Memory_Type True_Dual_Port_RAM \
  CONFIG.Read_Width_B 32 \
  CONFIG.Write_Depth_A 64 \
  CONFIG.Write_Width_A 32 \
  CONFIG.use_bram_block Stand_Alone \
] [get_bd_cells blk_mem_gen_61]
create_bd_cell -type ip -vlnv xilinx.com:ip:blk_mem_gen:8.4 blk_mem_gen_62
set_property -dict [list \
  CONFIG.Memory_Type True_Dual_Port_RAM \
  CONFIG.Read_Width_B 32 \
  CONFIG.Write_Depth_A 64 \
  CONFIG.Write_Width_A 32 \
  CONFIG.use_bram_block Stand_Alone \
] [get_bd_cells blk_mem_gen_62]
create_bd_cell -type ip -vlnv xilinx.com:ip:blk_mem_gen:8.4 blk_mem_gen_63
set_property -dict [list \
  CONFIG.Memory_Type True_Dual_Port_RAM \
  CONFIG.Read_Width_B 32 \
  CONFIG.Write_Depth_A 64 \
  CONFIG.Write_Width_A 32 \
  CONFIG.use_bram_block Stand_Alone \
] [get_bd_cells blk_mem_gen_63]
create_bd_cell -type ip -vlnv xilinx.com:ip:blk_mem_gen:8.4 blk_mem_gen_64
set_property -dict [list \
  CONFIG.Memory_Type True_Dual_Port_RAM \
  CONFIG.Read_Width_B 32 \
  CONFIG.Write_Depth_A 64 \
  CONFIG.Write_Width_A 32 \
  CONFIG.use_bram_block Stand_Alone \
] [get_bd_cells blk_mem_gen_64]
create_bd_cell -type ip -vlnv xilinx.com:ip:blk_mem_gen:8.4 blk_mem_gen_65
set_property -dict [list \
  CONFIG.Memory_Type True_Dual_Port_RAM \
  CONFIG.Read_Width_B 32 \
  CONFIG.Write_Depth_A 64 \
  CONFIG.Write_Width_A 32 \
  CONFIG.use_bram_block Stand_Alone \
] [get_bd_cells blk_mem_gen_65]
create_bd_cell -type ip -vlnv xilinx.com:ip:blk_mem_gen:8.4 blk_mem_gen_66
set_property -dict [list \
  CONFIG.Memory_Type True_Dual_Port_RAM \
  CONFIG.Read_Width_B 32 \
  CONFIG.Write_Depth_A 64 \
  CONFIG.Write_Width_A 32 \
  CONFIG.use_bram_block Stand_Alone \
] [get_bd_cells blk_mem_gen_66]
create_bd_cell -type ip -vlnv xilinx.com:ip:blk_mem_gen:8.4 blk_mem_gen_67
set_property -dict [list \
  CONFIG.Memory_Type True_Dual_Port_RAM \
  CONFIG.Read_Width_B 32 \
  CONFIG.Write_Depth_A 64 \
  CONFIG.Write_Width_A 32 \
  CONFIG.use_bram_block Stand_Alone \
] [get_bd_cells blk_mem_gen_67]
create_bd_cell -type ip -vlnv xilinx.com:ip:blk_mem_gen:8.4 blk_mem_gen_68
set_property -dict [list \
  CONFIG.Memory_Type True_Dual_Port_RAM \
  CONFIG.Read_Width_B 32 \
  CONFIG.Write_Depth_A 64 \
  CONFIG.Write_Width_A 32 \
  CONFIG.use_bram_block Stand_Alone \
] [get_bd_cells blk_mem_gen_68]
create_bd_cell -type ip -vlnv xilinx.com:ip:blk_mem_gen:8.4 blk_mem_gen_69
set_property -dict [list \
  CONFIG.Memory_Type True_Dual_Port_RAM \
  CONFIG.Read_Width_B 32 \
  CONFIG.Write_Depth_A 64 \
  CONFIG.Write_Width_A 32 \
  CONFIG.use_bram_block Stand_Alone \
] [get_bd_cells blk_mem_gen_69]
create_bd_cell -type ip -vlnv xilinx.com:ip:blk_mem_gen:8.4 blk_mem_gen_70
set_property -dict [list \
  CONFIG.Memory_Type True_Dual_Port_RAM \
  CONFIG.Read_Width_B 32 \
  CONFIG.Write_Depth_A 64 \
  CONFIG.Write_Width_A 32 \
  CONFIG.use_bram_block Stand_Alone \
] [get_bd_cells blk_mem_gen_70]
create_bd_cell -type ip -vlnv xilinx.com:ip:blk_mem_gen:8.4 blk_mem_gen_71
set_property -dict [list \
  CONFIG.Memory_Type True_Dual_Port_RAM \
  CONFIG.Read_Width_B 32 \
  CONFIG.Write_Depth_A 64 \
  CONFIG.Write_Width_A 32 \
  CONFIG.use_bram_block Stand_Alone \
] [get_bd_cells blk_mem_gen_71]
create_bd_cell -type ip -vlnv xilinx.com:ip:blk_mem_gen:8.4 blk_mem_gen_72
set_property -dict [list \
  CONFIG.Memory_Type True_Dual_Port_RAM \
  CONFIG.Read_Width_B 32 \
  CONFIG.Write_Depth_A 64 \
  CONFIG.Write_Width_A 32 \
  CONFIG.use_bram_block Stand_Alone \
] [get_bd_cells blk_mem_gen_72]
create_bd_cell -type ip -vlnv xilinx.com:ip:blk_mem_gen:8.4 blk_mem_gen_73
set_property -dict [list \
  CONFIG.Memory_Type True_Dual_Port_RAM \
  CONFIG.Read_Width_B 32 \
  CONFIG.Write_Depth_A 64 \
  CONFIG.Write_Width_A 32 \
  CONFIG.use_bram_block Stand_Alone \
] [get_bd_cells blk_mem_gen_73]
create_bd_cell -type ip -vlnv xilinx.com:ip:blk_mem_gen:8.4 blk_mem_gen_74
set_property -dict [list \
  CONFIG.Memory_Type True_Dual_Port_RAM \
  CONFIG.Read_Width_B 32 \
  CONFIG.Write_Depth_A 64 \
  CONFIG.Write_Width_A 32 \
  CONFIG.use_bram_block Stand_Alone \
] [get_bd_cells blk_mem_gen_74]
create_bd_cell -type ip -vlnv xilinx.com:ip:blk_mem_gen:8.4 blk_mem_gen_75
set_property -dict [list \
  CONFIG.Memory_Type True_Dual_Port_RAM \
  CONFIG.Read_Width_B 32 \
  CONFIG.Write_Depth_A 64 \
  CONFIG.Write_Width_A 32 \
  CONFIG.use_bram_block Stand_Alone \
] [get_bd_cells blk_mem_gen_75]
create_bd_cell -type ip -vlnv xilinx.com:ip:blk_mem_gen:8.4 blk_mem_gen_76
set_property -dict [list \
  CONFIG.Memory_Type True_Dual_Port_RAM \
  CONFIG.Read_Width_B 32 \
  CONFIG.Write_Depth_A 64 \
  CONFIG.Write_Width_A 32 \
  CONFIG.use_bram_block Stand_Alone \
] [get_bd_cells blk_mem_gen_76]
create_bd_cell -type ip -vlnv xilinx.com:ip:blk_mem_gen:8.4 blk_mem_gen_77
set_property -dict [list \
  CONFIG.Memory_Type True_Dual_Port_RAM \
  CONFIG.Read_Width_B 32 \
  CONFIG.Write_Depth_A 64 \
  CONFIG.Write_Width_A 32 \
  CONFIG.use_bram_block Stand_Alone \
] [get_bd_cells blk_mem_gen_77]
create_bd_cell -type ip -vlnv xilinx.com:ip:blk_mem_gen:8.4 blk_mem_gen_78
set_property -dict [list \
  CONFIG.Memory_Type True_Dual_Port_RAM \
  CONFIG.Read_Width_B 32 \
  CONFIG.Write_Depth_A 64 \
  CONFIG.Write_Width_A 32 \
  CONFIG.use_bram_block Stand_Alone \
] [get_bd_cells blk_mem_gen_78]
create_bd_cell -type ip -vlnv xilinx.com:ip:blk_mem_gen:8.4 blk_mem_gen_79
set_property -dict [list \
  CONFIG.Memory_Type True_Dual_Port_RAM \
  CONFIG.Read_Width_B 32 \
  CONFIG.Write_Depth_A 64 \
  CONFIG.Write_Width_A 32 \
  CONFIG.use_bram_block Stand_Alone \
] [get_bd_cells blk_mem_gen_79]
create_bd_cell -type ip -vlnv xilinx.com:ip:blk_mem_gen:8.4 blk_mem_gen_80
set_property -dict [list \
  CONFIG.Memory_Type True_Dual_Port_RAM \
  CONFIG.Read_Width_B 32 \
  CONFIG.Write_Depth_A 64 \
  CONFIG.Write_Width_A 32 \
  CONFIG.use_bram_block Stand_Alone \
] [get_bd_cells blk_mem_gen_80]
create_bd_cell -type ip -vlnv xilinx.com:ip:blk_mem_gen:8.4 blk_mem_gen_81
set_property -dict [list \
  CONFIG.Memory_Type True_Dual_Port_RAM \
  CONFIG.Read_Width_B 32 \
  CONFIG.Write_Depth_A 64 \
  CONFIG.Write_Width_A 32 \
  CONFIG.use_bram_block Stand_Alone \
] [get_bd_cells blk_mem_gen_81]
create_bd_cell -type ip -vlnv xilinx.com:ip:blk_mem_gen:8.4 blk_mem_gen_82
set_property -dict [list \
  CONFIG.Memory_Type True_Dual_Port_RAM \
  CONFIG.Read_Width_B 32 \
  CONFIG.Write_Depth_A 64 \
  CONFIG.Write_Width_A 32 \
  CONFIG.use_bram_block Stand_Alone \
] [get_bd_cells blk_mem_gen_82]
create_bd_cell -type ip -vlnv xilinx.com:ip:blk_mem_gen:8.4 blk_mem_gen_83
set_property -dict [list \
  CONFIG.Memory_Type True_Dual_Port_RAM \
  CONFIG.Read_Width_B 32 \
  CONFIG.Write_Depth_A 64 \
  CONFIG.Write_Width_A 32 \
  CONFIG.use_bram_block Stand_Alone \
] [get_bd_cells blk_mem_gen_83]
create_bd_cell -type ip -vlnv xilinx.com:ip:blk_mem_gen:8.4 blk_mem_gen_84
set_property -dict [list \
  CONFIG.Memory_Type True_Dual_Port_RAM \
  CONFIG.Read_Width_B 32 \
  CONFIG.Write_Depth_A 64 \
  CONFIG.Write_Width_A 32 \
  CONFIG.use_bram_block Stand_Alone \
] [get_bd_cells blk_mem_gen_84]
create_bd_cell -type ip -vlnv xilinx.com:ip:blk_mem_gen:8.4 blk_mem_gen_85
set_property -dict [list \
  CONFIG.Memory_Type True_Dual_Port_RAM \
  CONFIG.Read_Width_B 32 \
  CONFIG.Write_Depth_A 64 \
  CONFIG.Write_Width_A 32 \
  CONFIG.use_bram_block Stand_Alone \
] [get_bd_cells blk_mem_gen_85]
create_bd_cell -type ip -vlnv xilinx.com:ip:blk_mem_gen:8.4 blk_mem_gen_86
set_property -dict [list \
  CONFIG.Memory_Type True_Dual_Port_RAM \
  CONFIG.Read_Width_B 32 \
  CONFIG.Write_Depth_A 64 \
  CONFIG.Write_Width_A 32 \
  CONFIG.use_bram_block Stand_Alone \
] [get_bd_cells blk_mem_gen_86]
create_bd_cell -type ip -vlnv xilinx.com:ip:blk_mem_gen:8.4 blk_mem_gen_87
set_property -dict [list \
  CONFIG.Memory_Type True_Dual_Port_RAM \
  CONFIG.Read_Width_B 32 \
  CONFIG.Write_Depth_A 64 \
  CONFIG.Write_Width_A 32 \
  CONFIG.use_bram_block Stand_Alone \
] [get_bd_cells blk_mem_gen_87]
create_bd_cell -type ip -vlnv xilinx.com:ip:blk_mem_gen:8.4 blk_mem_gen_88
set_property -dict [list \
  CONFIG.Memory_Type True_Dual_Port_RAM \
  CONFIG.Read_Width_B 32 \
  CONFIG.Write_Depth_A 64 \
  CONFIG.Write_Width_A 32 \
  CONFIG.use_bram_block Stand_Alone \
] [get_bd_cells blk_mem_gen_88]
create_bd_cell -type ip -vlnv xilinx.com:ip:blk_mem_gen:8.4 blk_mem_gen_89
set_property -dict [list \
  CONFIG.Memory_Type True_Dual_Port_RAM \
  CONFIG.Read_Width_B 32 \
  CONFIG.Write_Depth_A 64 \
  CONFIG.Write_Width_A 32 \
  CONFIG.use_bram_block Stand_Alone \
] [get_bd_cells blk_mem_gen_89]
create_bd_cell -type ip -vlnv xilinx.com:ip:blk_mem_gen:8.4 blk_mem_gen_90
set_property -dict [list \
  CONFIG.Memory_Type True_Dual_Port_RAM \
  CONFIG.Read_Width_B 32 \
  CONFIG.Write_Depth_A 64 \
  CONFIG.Write_Width_A 32 \
  CONFIG.use_bram_block Stand_Alone \
] [get_bd_cells blk_mem_gen_90]
create_bd_cell -type ip -vlnv xilinx.com:ip:blk_mem_gen:8.4 blk_mem_gen_91
set_property -dict [list \
  CONFIG.Memory_Type True_Dual_Port_RAM \
  CONFIG.Read_Width_B 32 \
  CONFIG.Write_Depth_A 64 \
  CONFIG.Write_Width_A 32 \
  CONFIG.use_bram_block Stand_Alone \
] [get_bd_cells blk_mem_gen_91]
create_bd_cell -type ip -vlnv xilinx.com:ip:blk_mem_gen:8.4 blk_mem_gen_92
set_property -dict [list \
  CONFIG.Memory_Type True_Dual_Port_RAM \
  CONFIG.Read_Width_B 32 \
  CONFIG.Write_Depth_A 64 \
  CONFIG.Write_Width_A 32 \
  CONFIG.use_bram_block Stand_Alone \
] [get_bd_cells blk_mem_gen_92]
create_bd_cell -type ip -vlnv xilinx.com:ip:blk_mem_gen:8.4 blk_mem_gen_93
set_property -dict [list \
  CONFIG.Memory_Type True_Dual_Port_RAM \
  CONFIG.Read_Width_B 32 \
  CONFIG.Write_Depth_A 64 \
  CONFIG.Write_Width_A 32 \
  CONFIG.use_bram_block Stand_Alone \
] [get_bd_cells blk_mem_gen_93]
create_bd_cell -type ip -vlnv xilinx.com:ip:blk_mem_gen:8.4 blk_mem_gen_94
set_property -dict [list \
  CONFIG.Memory_Type True_Dual_Port_RAM \
  CONFIG.Read_Width_B 32 \
  CONFIG.Write_Depth_A 64 \
  CONFIG.Write_Width_A 32 \
  CONFIG.use_bram_block Stand_Alone \
] [get_bd_cells blk_mem_gen_94]
create_bd_cell -type ip -vlnv xilinx.com:ip:blk_mem_gen:8.4 blk_mem_gen_95
set_property -dict [list \
  CONFIG.Memory_Type True_Dual_Port_RAM \
  CONFIG.Read_Width_B 32 \
  CONFIG.Write_Depth_A 64 \
  CONFIG.Write_Width_A 32 \
  CONFIG.use_bram_block Stand_Alone \
] [get_bd_cells blk_mem_gen_95]
create_bd_cell -type ip -vlnv xilinx.com:ip:blk_mem_gen:8.4 blk_mem_gen_96
set_property -dict [list \
  CONFIG.Memory_Type True_Dual_Port_RAM \
  CONFIG.Read_Width_B 32 \
  CONFIG.Write_Depth_A 64 \
  CONFIG.Write_Width_A 32 \
  CONFIG.use_bram_block Stand_Alone \
] [get_bd_cells blk_mem_gen_96]
create_bd_cell -type ip -vlnv xilinx.com:ip:blk_mem_gen:8.4 blk_mem_gen_97
set_property -dict [list \
  CONFIG.Memory_Type True_Dual_Port_RAM \
  CONFIG.Read_Width_B 32 \
  CONFIG.Write_Depth_A 64 \
  CONFIG.Write_Width_A 32 \
  CONFIG.use_bram_block Stand_Alone \
] [get_bd_cells blk_mem_gen_97]
create_bd_cell -type ip -vlnv xilinx.com:ip:blk_mem_gen:8.4 blk_mem_gen_98
set_property -dict [list \
  CONFIG.Memory_Type True_Dual_Port_RAM \
  CONFIG.Read_Width_B 32 \
  CONFIG.Write_Depth_A 64 \
  CONFIG.Write_Width_A 32 \
  CONFIG.use_bram_block Stand_Alone \
] [get_bd_cells blk_mem_gen_98]
create_bd_cell -type ip -vlnv xilinx.com:ip:blk_mem_gen:8.4 blk_mem_gen_99
set_property -dict [list \
  CONFIG.Memory_Type True_Dual_Port_RAM \
  CONFIG.Read_Width_B 32 \
  CONFIG.Write_Depth_A 64 \
  CONFIG.Write_Width_A 32 \
  CONFIG.use_bram_block Stand_Alone \
] [get_bd_cells blk_mem_gen_99]
create_bd_cell -type ip -vlnv xilinx.com:ip:blk_mem_gen:8.4 blk_mem_gen_100
set_property -dict [list \
  CONFIG.Memory_Type True_Dual_Port_RAM \
  CONFIG.Read_Width_B 32 \
  CONFIG.Write_Depth_A 64 \
  CONFIG.Write_Width_A 32 \
  CONFIG.use_bram_block Stand_Alone \
] [get_bd_cells blk_mem_gen_100]
create_bd_cell -type ip -vlnv xilinx.com:ip:blk_mem_gen:8.4 blk_mem_gen_101
set_property -dict [list \
  CONFIG.Memory_Type True_Dual_Port_RAM \
  CONFIG.Read_Width_B 32 \
  CONFIG.Write_Depth_A 64 \
  CONFIG.Write_Width_A 32 \
  CONFIG.use_bram_block Stand_Alone \
] [get_bd_cells blk_mem_gen_101]
create_bd_cell -type ip -vlnv xilinx.com:ip:blk_mem_gen:8.4 blk_mem_gen_102
set_property -dict [list \
  CONFIG.Memory_Type True_Dual_Port_RAM \
  CONFIG.Read_Width_B 32 \
  CONFIG.Write_Depth_A 64 \
  CONFIG.Write_Width_A 32 \
  CONFIG.use_bram_block Stand_Alone \
] [get_bd_cells blk_mem_gen_102]
create_bd_cell -type ip -vlnv xilinx.com:ip:blk_mem_gen:8.4 blk_mem_gen_103
set_property -dict [list \
  CONFIG.Memory_Type True_Dual_Port_RAM \
  CONFIG.Read_Width_B 32 \
  CONFIG.Write_Depth_A 64 \
  CONFIG.Write_Width_A 32 \
  CONFIG.use_bram_block Stand_Alone \
] [get_bd_cells blk_mem_gen_103]
create_bd_cell -type ip -vlnv xilinx.com:ip:blk_mem_gen:8.4 blk_mem_gen_104
set_property -dict [list \
  CONFIG.Memory_Type True_Dual_Port_RAM \
  CONFIG.Read_Width_B 32 \
  CONFIG.Write_Depth_A 64 \
  CONFIG.Write_Width_A 32 \
  CONFIG.use_bram_block Stand_Alone \
] [get_bd_cells blk_mem_gen_104]
create_bd_cell -type ip -vlnv xilinx.com:ip:blk_mem_gen:8.4 blk_mem_gen_105
set_property -dict [list \
  CONFIG.Memory_Type True_Dual_Port_RAM \
  CONFIG.Read_Width_B 32 \
  CONFIG.Write_Depth_A 64 \
  CONFIG.Write_Width_A 32 \
  CONFIG.use_bram_block Stand_Alone \
] [get_bd_cells blk_mem_gen_105]
create_bd_cell -type ip -vlnv xilinx.com:ip:blk_mem_gen:8.4 blk_mem_gen_106
set_property -dict [list \
  CONFIG.Memory_Type True_Dual_Port_RAM \
  CONFIG.Read_Width_B 32 \
  CONFIG.Write_Depth_A 64 \
  CONFIG.Write_Width_A 32 \
  CONFIG.use_bram_block Stand_Alone \
] [get_bd_cells blk_mem_gen_106]
create_bd_cell -type ip -vlnv xilinx.com:ip:blk_mem_gen:8.4 blk_mem_gen_107
set_property -dict [list \
  CONFIG.Memory_Type True_Dual_Port_RAM \
  CONFIG.Read_Width_B 32 \
  CONFIG.Write_Depth_A 64 \
  CONFIG.Write_Width_A 32 \
  CONFIG.use_bram_block Stand_Alone \
] [get_bd_cells blk_mem_gen_107]
create_bd_cell -type ip -vlnv xilinx.com:ip:blk_mem_gen:8.4 blk_mem_gen_108
set_property -dict [list \
  CONFIG.Memory_Type True_Dual_Port_RAM \
  CONFIG.Read_Width_B 39 \
  CONFIG.Write_Depth_A 20 \
  CONFIG.Write_Width_A 39 \
  CONFIG.use_bram_block Stand_Alone \
] [get_bd_cells blk_mem_gen_108]
create_bd_cell -type module -reference CGRATop CGRATop_0

# ---- connections ----

connect_bd_net [get_bd_pins CGRATop_0/IglobalDataOut] [get_bd_ports IdataOut]
connect_bd_net [get_bd_pins CGRATop_0/globalDataOut] [get_bd_ports dataOut]
connect_bd_net [get_bd_pins CGRATop_0/mAddr1] [get_bd_pins MEMDock_0/MEMAddrIn1]
connect_bd_net [get_bd_pins CGRATop_0/mAddr2] [get_bd_pins MEMDock_0/MEMAddrIn2]
connect_bd_net [get_bd_pins CGRATop_0/mDataToMem] [get_bd_pins MEMDock_0/mLocalDataIn]
connect_bd_net [get_bd_pins CGRATop_0/mEn1] [get_bd_pins MEMDock_0/MEMEnIn1]
connect_bd_net [get_bd_pins CGRATop_0/mEn2] [get_bd_pins MEMDock_0/MEMEnIn2]
connect_bd_net [get_bd_pins CGRATop_0/mIAddr1] [get_bd_pins MEMDock_0/IMEMAddrIn1]
connect_bd_net [get_bd_pins CGRATop_0/mIAddr2] [get_bd_pins MEMDock_0/IMEMAddrIn2]
connect_bd_net [get_bd_pins CGRATop_0/mIDataToMem] [get_bd_pins MEMDock_0/mILocalDataIn]
connect_bd_net [get_bd_pins CGRATop_0/mIEn1] [get_bd_pins MEMDock_0/IMEMEnIn1]
connect_bd_net [get_bd_pins CGRATop_0/mIEn2] [get_bd_pins MEMDock_0/IMEMEnIn2]
connect_bd_net [get_bd_pins CGRATop_0/mIWEn1] [get_bd_pins MEMDock_0/IMEMRWEnIn1]
connect_bd_net [get_bd_pins CGRATop_0/mIWEn2] [get_bd_pins MEMDock_0/IMEMRWEnIn2]
connect_bd_net [get_bd_pins CGRATop_0/mWEn1] [get_bd_pins MEMDock_0/MEMRWEnIn1]
connect_bd_net [get_bd_pins CGRATop_0/mWEn2] [get_bd_pins MEMDock_0/MEMRWEnIn2]
connect_bd_net [get_bd_ports IOConfig] [get_bd_pins CGRATop_0/IOConfig]
connect_bd_net -net IaddrIn1_1 [get_bd_ports IaddrIn1] [get_bd_pins CGRATop_0/IstartAddr1]
connect_bd_net -net IaddrIn2_1 [get_bd_ports IaddrIn2] [get_bd_pins CGRATop_0/IstartAddr2]
connect_bd_net -net Icount1_1 [get_bd_ports Icount1] [get_bd_pins CGRATop_0/Icount1]
connect_bd_net -net Icount2_1 [get_bd_ports Icount2] [get_bd_pins CGRATop_0/Icount2]
connect_bd_net [get_bd_ports IdataIn] [get_bd_pins CGRATop_0/IglobalDataIn]
connect_bd_net -net IstrideIn1_1 [get_bd_ports IstrideIn1] [get_bd_pins CGRATop_0/Istride1]
connect_bd_net -net IstrideIn2_1 [get_bd_ports IstrideIn2] [get_bd_pins CGRATop_0/Istride2]
connect_bd_net -net IvalidIn1_1 [get_bd_ports IvalidIn1] [get_bd_pins CGRATop_0/Ivalid1]
connect_bd_net -net IvalidIn2_1 [get_bd_ports IvalidIn2] [get_bd_pins CGRATop_0/Ivalid2]
connect_bd_net -net IwriteEnIn1_1 [get_bd_ports IwriteEnIn1] [get_bd_pins CGRATop_0/IWEn1]
connect_bd_net -net IwriteEnIn2_1 [get_bd_ports IwriteEnIn2] [get_bd_pins CGRATop_0/IWEn2]
connect_bd_net [get_bd_pins MEMDock_0/IMEMAddrOut1] [get_bd_pins blk_mem_gen_108/addra]
connect_bd_net [get_bd_pins MEMDock_0/IMEMAddrOut2] [get_bd_pins blk_mem_gen_108/addrb]
connect_bd_net [get_bd_pins MEMDock_0/IMEMDataOut] [get_bd_pins blk_mem_gen_108/dina]
connect_bd_net [get_bd_pins MEMDock_0/IMEMEnOut1] [get_bd_pins blk_mem_gen_108/ena]
connect_bd_net [get_bd_pins MEMDock_0/IMEMEnOut2] [get_bd_pins blk_mem_gen_108/enb]
connect_bd_net [get_bd_pins MEMDock_0/IMEMRWEnOut1] [get_bd_pins blk_mem_gen_108/wea]
connect_bd_net [get_bd_pins MEMDock_0/IMEMRWEnOut2] [get_bd_pins blk_mem_gen_108/web]
connect_bd_net [get_bd_pins MEMDock_0/MEMAddrOut10] [get_bd_pins blk_mem_gen_0/addra]
connect_bd_net [get_bd_pins MEMDock_0/MEMAddrOut11] [get_bd_pins blk_mem_gen_1/addra]
connect_bd_net [get_bd_pins MEMDock_0/MEMAddrOut12] [get_bd_pins blk_mem_gen_2/addra]
connect_bd_net [get_bd_pins MEMDock_0/MEMAddrOut13] [get_bd_pins blk_mem_gen_3/addra]
connect_bd_net [get_bd_pins MEMDock_0/MEMAddrOut14] [get_bd_pins blk_mem_gen_4/addra]
connect_bd_net [get_bd_pins MEMDock_0/MEMAddrOut15] [get_bd_pins blk_mem_gen_5/addra]
connect_bd_net [get_bd_pins MEMDock_0/MEMAddrOut16] [get_bd_pins blk_mem_gen_6/addra]
connect_bd_net [get_bd_pins MEMDock_0/MEMAddrOut17] [get_bd_pins blk_mem_gen_7/addra]
connect_bd_net [get_bd_pins MEMDock_0/MEMAddrOut18] [get_bd_pins blk_mem_gen_8/addra]
connect_bd_net [get_bd_pins MEMDock_0/MEMAddrOut19] [get_bd_pins blk_mem_gen_9/addra]
connect_bd_net [get_bd_pins MEMDock_0/MEMAddrOut20] [get_bd_pins blk_mem_gen_0/addrb]
connect_bd_net [get_bd_pins MEMDock_0/MEMAddrOut21] [get_bd_pins blk_mem_gen_1/addrb]
connect_bd_net [get_bd_pins MEMDock_0/MEMAddrOut22] [get_bd_pins blk_mem_gen_2/addrb]
connect_bd_net [get_bd_pins MEMDock_0/MEMAddrOut23] [get_bd_pins blk_mem_gen_3/addrb]
connect_bd_net [get_bd_pins MEMDock_0/MEMAddrOut24] [get_bd_pins blk_mem_gen_4/addrb]
connect_bd_net [get_bd_pins MEMDock_0/MEMAddrOut25] [get_bd_pins blk_mem_gen_5/addrb]
connect_bd_net [get_bd_pins MEMDock_0/MEMAddrOut26] [get_bd_pins blk_mem_gen_6/addrb]
connect_bd_net [get_bd_pins MEMDock_0/MEMAddrOut27] [get_bd_pins blk_mem_gen_7/addrb]
connect_bd_net [get_bd_pins MEMDock_0/MEMAddrOut28] [get_bd_pins blk_mem_gen_8/addrb]
connect_bd_net [get_bd_pins MEMDock_0/MEMAddrOut29] [get_bd_pins blk_mem_gen_9/addrb]
connect_bd_net [get_bd_pins MEMDock_0/MEMAddrOut110] [get_bd_pins blk_mem_gen_10/addra]
connect_bd_net [get_bd_pins MEMDock_0/MEMAddrOut111] [get_bd_pins blk_mem_gen_11/addra]
connect_bd_net [get_bd_pins MEMDock_0/MEMAddrOut112] [get_bd_pins blk_mem_gen_12/addra]
connect_bd_net [get_bd_pins MEMDock_0/MEMAddrOut113] [get_bd_pins blk_mem_gen_13/addra]
connect_bd_net [get_bd_pins MEMDock_0/MEMAddrOut114] [get_bd_pins blk_mem_gen_14/addra]
connect_bd_net [get_bd_pins MEMDock_0/MEMAddrOut115] [get_bd_pins blk_mem_gen_15/addra]
connect_bd_net [get_bd_pins MEMDock_0/MEMAddrOut116] [get_bd_pins blk_mem_gen_16/addra]
connect_bd_net [get_bd_pins MEMDock_0/MEMAddrOut117] [get_bd_pins blk_mem_gen_17/addra]
connect_bd_net [get_bd_pins MEMDock_0/MEMAddrOut118] [get_bd_pins blk_mem_gen_18/addra]
connect_bd_net [get_bd_pins MEMDock_0/MEMAddrOut119] [get_bd_pins blk_mem_gen_19/addra]
connect_bd_net [get_bd_pins MEMDock_0/MEMAddrOut120] [get_bd_pins blk_mem_gen_20/addra]
connect_bd_net [get_bd_pins MEMDock_0/MEMAddrOut121] [get_bd_pins blk_mem_gen_21/addra]
connect_bd_net [get_bd_pins MEMDock_0/MEMAddrOut122] [get_bd_pins blk_mem_gen_22/addra]
connect_bd_net [get_bd_pins MEMDock_0/MEMAddrOut123] [get_bd_pins blk_mem_gen_23/addra]
connect_bd_net [get_bd_pins MEMDock_0/MEMAddrOut124] [get_bd_pins blk_mem_gen_24/addra]
connect_bd_net [get_bd_pins MEMDock_0/MEMAddrOut125] [get_bd_pins blk_mem_gen_25/addra]
connect_bd_net [get_bd_pins MEMDock_0/MEMAddrOut126] [get_bd_pins blk_mem_gen_26/addra]
connect_bd_net [get_bd_pins MEMDock_0/MEMAddrOut127] [get_bd_pins blk_mem_gen_27/addra]
connect_bd_net [get_bd_pins MEMDock_0/MEMAddrOut128] [get_bd_pins blk_mem_gen_28/addra]
connect_bd_net [get_bd_pins MEMDock_0/MEMAddrOut129] [get_bd_pins blk_mem_gen_29/addra]
connect_bd_net [get_bd_pins MEMDock_0/MEMAddrOut130] [get_bd_pins blk_mem_gen_30/addra]
connect_bd_net [get_bd_pins MEMDock_0/MEMAddrOut131] [get_bd_pins blk_mem_gen_31/addra]
connect_bd_net [get_bd_pins MEMDock_0/MEMAddrOut132] [get_bd_pins blk_mem_gen_32/addra]
connect_bd_net [get_bd_pins MEMDock_0/MEMAddrOut133] [get_bd_pins blk_mem_gen_33/addra]
connect_bd_net [get_bd_pins MEMDock_0/MEMAddrOut134] [get_bd_pins blk_mem_gen_34/addra]
connect_bd_net [get_bd_pins MEMDock_0/MEMAddrOut135] [get_bd_pins blk_mem_gen_35/addra]
connect_bd_net [get_bd_pins MEMDock_0/MEMAddrOut136] [get_bd_pins blk_mem_gen_36/addra]
connect_bd_net [get_bd_pins MEMDock_0/MEMAddrOut137] [get_bd_pins blk_mem_gen_37/addra]
connect_bd_net [get_bd_pins MEMDock_0/MEMAddrOut138] [get_bd_pins blk_mem_gen_38/addra]
connect_bd_net [get_bd_pins MEMDock_0/MEMAddrOut139] [get_bd_pins blk_mem_gen_39/addra]
connect_bd_net [get_bd_pins MEMDock_0/MEMAddrOut140] [get_bd_pins blk_mem_gen_40/addra]
connect_bd_net [get_bd_pins MEMDock_0/MEMAddrOut141] [get_bd_pins blk_mem_gen_41/addra]
connect_bd_net [get_bd_pins MEMDock_0/MEMAddrOut142] [get_bd_pins blk_mem_gen_42/addra]
connect_bd_net [get_bd_pins MEMDock_0/MEMAddrOut143] [get_bd_pins blk_mem_gen_43/addra]
connect_bd_net [get_bd_pins MEMDock_0/MEMAddrOut144] [get_bd_pins blk_mem_gen_44/addra]
connect_bd_net [get_bd_pins MEMDock_0/MEMAddrOut145] [get_bd_pins blk_mem_gen_45/addra]
connect_bd_net [get_bd_pins MEMDock_0/MEMAddrOut146] [get_bd_pins blk_mem_gen_46/addra]
connect_bd_net [get_bd_pins MEMDock_0/MEMAddrOut147] [get_bd_pins blk_mem_gen_47/addra]
connect_bd_net [get_bd_pins MEMDock_0/MEMAddrOut148] [get_bd_pins blk_mem_gen_48/addra]
connect_bd_net [get_bd_pins MEMDock_0/MEMAddrOut149] [get_bd_pins blk_mem_gen_49/addra]
connect_bd_net [get_bd_pins MEMDock_0/MEMAddrOut150] [get_bd_pins blk_mem_gen_50/addra]
connect_bd_net [get_bd_pins MEMDock_0/MEMAddrOut151] [get_bd_pins blk_mem_gen_51/addra]
connect_bd_net [get_bd_pins MEMDock_0/MEMAddrOut152] [get_bd_pins blk_mem_gen_52/addra]
connect_bd_net [get_bd_pins MEMDock_0/MEMAddrOut153] [get_bd_pins blk_mem_gen_53/addra]
connect_bd_net [get_bd_pins MEMDock_0/MEMAddrOut154] [get_bd_pins blk_mem_gen_54/addra]
connect_bd_net [get_bd_pins MEMDock_0/MEMAddrOut155] [get_bd_pins blk_mem_gen_55/addra]
connect_bd_net [get_bd_pins MEMDock_0/MEMAddrOut156] [get_bd_pins blk_mem_gen_56/addra]
connect_bd_net [get_bd_pins MEMDock_0/MEMAddrOut157] [get_bd_pins blk_mem_gen_57/addra]
connect_bd_net [get_bd_pins MEMDock_0/MEMAddrOut158] [get_bd_pins blk_mem_gen_58/addra]
connect_bd_net [get_bd_pins MEMDock_0/MEMAddrOut159] [get_bd_pins blk_mem_gen_59/addra]
connect_bd_net [get_bd_pins MEMDock_0/MEMAddrOut160] [get_bd_pins blk_mem_gen_60/addra]
connect_bd_net [get_bd_pins MEMDock_0/MEMAddrOut161] [get_bd_pins blk_mem_gen_61/addra]
connect_bd_net [get_bd_pins MEMDock_0/MEMAddrOut162] [get_bd_pins blk_mem_gen_62/addra]
connect_bd_net [get_bd_pins MEMDock_0/MEMAddrOut163] [get_bd_pins blk_mem_gen_63/addra]
connect_bd_net [get_bd_pins MEMDock_0/MEMAddrOut164] [get_bd_pins blk_mem_gen_64/addra]
connect_bd_net [get_bd_pins MEMDock_0/MEMAddrOut165] [get_bd_pins blk_mem_gen_65/addra]
connect_bd_net [get_bd_pins MEMDock_0/MEMAddrOut166] [get_bd_pins blk_mem_gen_66/addra]
connect_bd_net [get_bd_pins MEMDock_0/MEMAddrOut167] [get_bd_pins blk_mem_gen_67/addra]
connect_bd_net [get_bd_pins MEMDock_0/MEMAddrOut168] [get_bd_pins blk_mem_gen_68/addra]
connect_bd_net [get_bd_pins MEMDock_0/MEMAddrOut169] [get_bd_pins blk_mem_gen_69/addra]
connect_bd_net [get_bd_pins MEMDock_0/MEMAddrOut170] [get_bd_pins blk_mem_gen_70/addra]
connect_bd_net [get_bd_pins MEMDock_0/MEMAddrOut171] [get_bd_pins blk_mem_gen_71/addra]
connect_bd_net [get_bd_pins MEMDock_0/MEMAddrOut172] [get_bd_pins blk_mem_gen_72/addra]
connect_bd_net [get_bd_pins MEMDock_0/MEMAddrOut173] [get_bd_pins blk_mem_gen_73/addra]
connect_bd_net [get_bd_pins MEMDock_0/MEMAddrOut174] [get_bd_pins blk_mem_gen_74/addra]
connect_bd_net [get_bd_pins MEMDock_0/MEMAddrOut175] [get_bd_pins blk_mem_gen_75/addra]
connect_bd_net [get_bd_pins MEMDock_0/MEMAddrOut176] [get_bd_pins blk_mem_gen_76/addra]
connect_bd_net [get_bd_pins MEMDock_0/MEMAddrOut177] [get_bd_pins blk_mem_gen_77/addra]
connect_bd_net [get_bd_pins MEMDock_0/MEMAddrOut178] [get_bd_pins blk_mem_gen_78/addra]
connect_bd_net [get_bd_pins MEMDock_0/MEMAddrOut179] [get_bd_pins blk_mem_gen_79/addra]
connect_bd_net [get_bd_pins MEMDock_0/MEMAddrOut180] [get_bd_pins blk_mem_gen_80/addra]
connect_bd_net [get_bd_pins MEMDock_0/MEMAddrOut181] [get_bd_pins blk_mem_gen_81/addra]
connect_bd_net [get_bd_pins MEMDock_0/MEMAddrOut182] [get_bd_pins blk_mem_gen_82/addra]
connect_bd_net [get_bd_pins MEMDock_0/MEMAddrOut183] [get_bd_pins blk_mem_gen_83/addra]
connect_bd_net [get_bd_pins MEMDock_0/MEMAddrOut184] [get_bd_pins blk_mem_gen_84/addra]
connect_bd_net [get_bd_pins MEMDock_0/MEMAddrOut185] [get_bd_pins blk_mem_gen_85/addra]
connect_bd_net [get_bd_pins MEMDock_0/MEMAddrOut186] [get_bd_pins blk_mem_gen_86/addra]
connect_bd_net [get_bd_pins MEMDock_0/MEMAddrOut187] [get_bd_pins blk_mem_gen_87/addra]
connect_bd_net [get_bd_pins MEMDock_0/MEMAddrOut188] [get_bd_pins blk_mem_gen_88/addra]
connect_bd_net [get_bd_pins MEMDock_0/MEMAddrOut189] [get_bd_pins blk_mem_gen_89/addra]
connect_bd_net [get_bd_pins MEMDock_0/MEMAddrOut190] [get_bd_pins blk_mem_gen_90/addra]
connect_bd_net [get_bd_pins MEMDock_0/MEMAddrOut191] [get_bd_pins blk_mem_gen_91/addra]
connect_bd_net [get_bd_pins MEMDock_0/MEMAddrOut192] [get_bd_pins blk_mem_gen_92/addra]
connect_bd_net [get_bd_pins MEMDock_0/MEMAddrOut193] [get_bd_pins blk_mem_gen_93/addra]
connect_bd_net [get_bd_pins MEMDock_0/MEMAddrOut194] [get_bd_pins blk_mem_gen_94/addra]
connect_bd_net [get_bd_pins MEMDock_0/MEMAddrOut195] [get_bd_pins blk_mem_gen_95/addra]
connect_bd_net [get_bd_pins MEMDock_0/MEMAddrOut196] [get_bd_pins blk_mem_gen_96/addra]
connect_bd_net [get_bd_pins MEMDock_0/MEMAddrOut197] [get_bd_pins blk_mem_gen_97/addra]
connect_bd_net [get_bd_pins MEMDock_0/MEMAddrOut198] [get_bd_pins blk_mem_gen_98/addra]
connect_bd_net [get_bd_pins MEMDock_0/MEMAddrOut199] [get_bd_pins blk_mem_gen_99/addra]
connect_bd_net [get_bd_pins MEMDock_0/MEMAddrOut210] [get_bd_pins blk_mem_gen_10/addrb]
connect_bd_net [get_bd_pins MEMDock_0/MEMAddrOut211] [get_bd_pins blk_mem_gen_11/addrb]
connect_bd_net [get_bd_pins MEMDock_0/MEMAddrOut212] [get_bd_pins blk_mem_gen_12/addrb]
connect_bd_net [get_bd_pins MEMDock_0/MEMAddrOut213] [get_bd_pins blk_mem_gen_13/addrb]
connect_bd_net [get_bd_pins MEMDock_0/MEMAddrOut214] [get_bd_pins blk_mem_gen_14/addrb]
connect_bd_net [get_bd_pins MEMDock_0/MEMAddrOut215] [get_bd_pins blk_mem_gen_15/addrb]
connect_bd_net [get_bd_pins MEMDock_0/MEMAddrOut216] [get_bd_pins blk_mem_gen_16/addrb]
connect_bd_net [get_bd_pins MEMDock_0/MEMAddrOut217] [get_bd_pins blk_mem_gen_17/addrb]
connect_bd_net [get_bd_pins MEMDock_0/MEMAddrOut218] [get_bd_pins blk_mem_gen_18/addrb]
connect_bd_net [get_bd_pins MEMDock_0/MEMAddrOut219] [get_bd_pins blk_mem_gen_19/addrb]
connect_bd_net [get_bd_pins MEMDock_0/MEMAddrOut220] [get_bd_pins blk_mem_gen_20/addrb]
connect_bd_net [get_bd_pins MEMDock_0/MEMAddrOut221] [get_bd_pins blk_mem_gen_21/addrb]
connect_bd_net [get_bd_pins MEMDock_0/MEMAddrOut222] [get_bd_pins blk_mem_gen_22/addrb]
connect_bd_net [get_bd_pins MEMDock_0/MEMAddrOut223] [get_bd_pins blk_mem_gen_23/addrb]
connect_bd_net [get_bd_pins MEMDock_0/MEMAddrOut224] [get_bd_pins blk_mem_gen_24/addrb]
connect_bd_net [get_bd_pins MEMDock_0/MEMAddrOut225] [get_bd_pins blk_mem_gen_25/addrb]
connect_bd_net [get_bd_pins MEMDock_0/MEMAddrOut226] [get_bd_pins blk_mem_gen_26/addrb]
connect_bd_net [get_bd_pins MEMDock_0/MEMAddrOut227] [get_bd_pins blk_mem_gen_27/addrb]
connect_bd_net [get_bd_pins MEMDock_0/MEMAddrOut228] [get_bd_pins blk_mem_gen_28/addrb]
connect_bd_net [get_bd_pins MEMDock_0/MEMAddrOut229] [get_bd_pins blk_mem_gen_29/addrb]
connect_bd_net [get_bd_pins MEMDock_0/MEMAddrOut230] [get_bd_pins blk_mem_gen_30/addrb]
connect_bd_net [get_bd_pins MEMDock_0/MEMAddrOut231] [get_bd_pins blk_mem_gen_31/addrb]
connect_bd_net [get_bd_pins MEMDock_0/MEMAddrOut232] [get_bd_pins blk_mem_gen_32/addrb]
connect_bd_net [get_bd_pins MEMDock_0/MEMAddrOut233] [get_bd_pins blk_mem_gen_33/addrb]
connect_bd_net [get_bd_pins MEMDock_0/MEMAddrOut234] [get_bd_pins blk_mem_gen_34/addrb]
connect_bd_net [get_bd_pins MEMDock_0/MEMAddrOut235] [get_bd_pins blk_mem_gen_35/addrb]
connect_bd_net [get_bd_pins MEMDock_0/MEMAddrOut236] [get_bd_pins blk_mem_gen_36/addrb]
connect_bd_net [get_bd_pins MEMDock_0/MEMAddrOut237] [get_bd_pins blk_mem_gen_37/addrb]
connect_bd_net [get_bd_pins MEMDock_0/MEMAddrOut238] [get_bd_pins blk_mem_gen_38/addrb]
connect_bd_net [get_bd_pins MEMDock_0/MEMAddrOut239] [get_bd_pins blk_mem_gen_39/addrb]
